# Altium project EVMOMAPL137_Orcad_revg.PrjPcb (part 1 of 4)
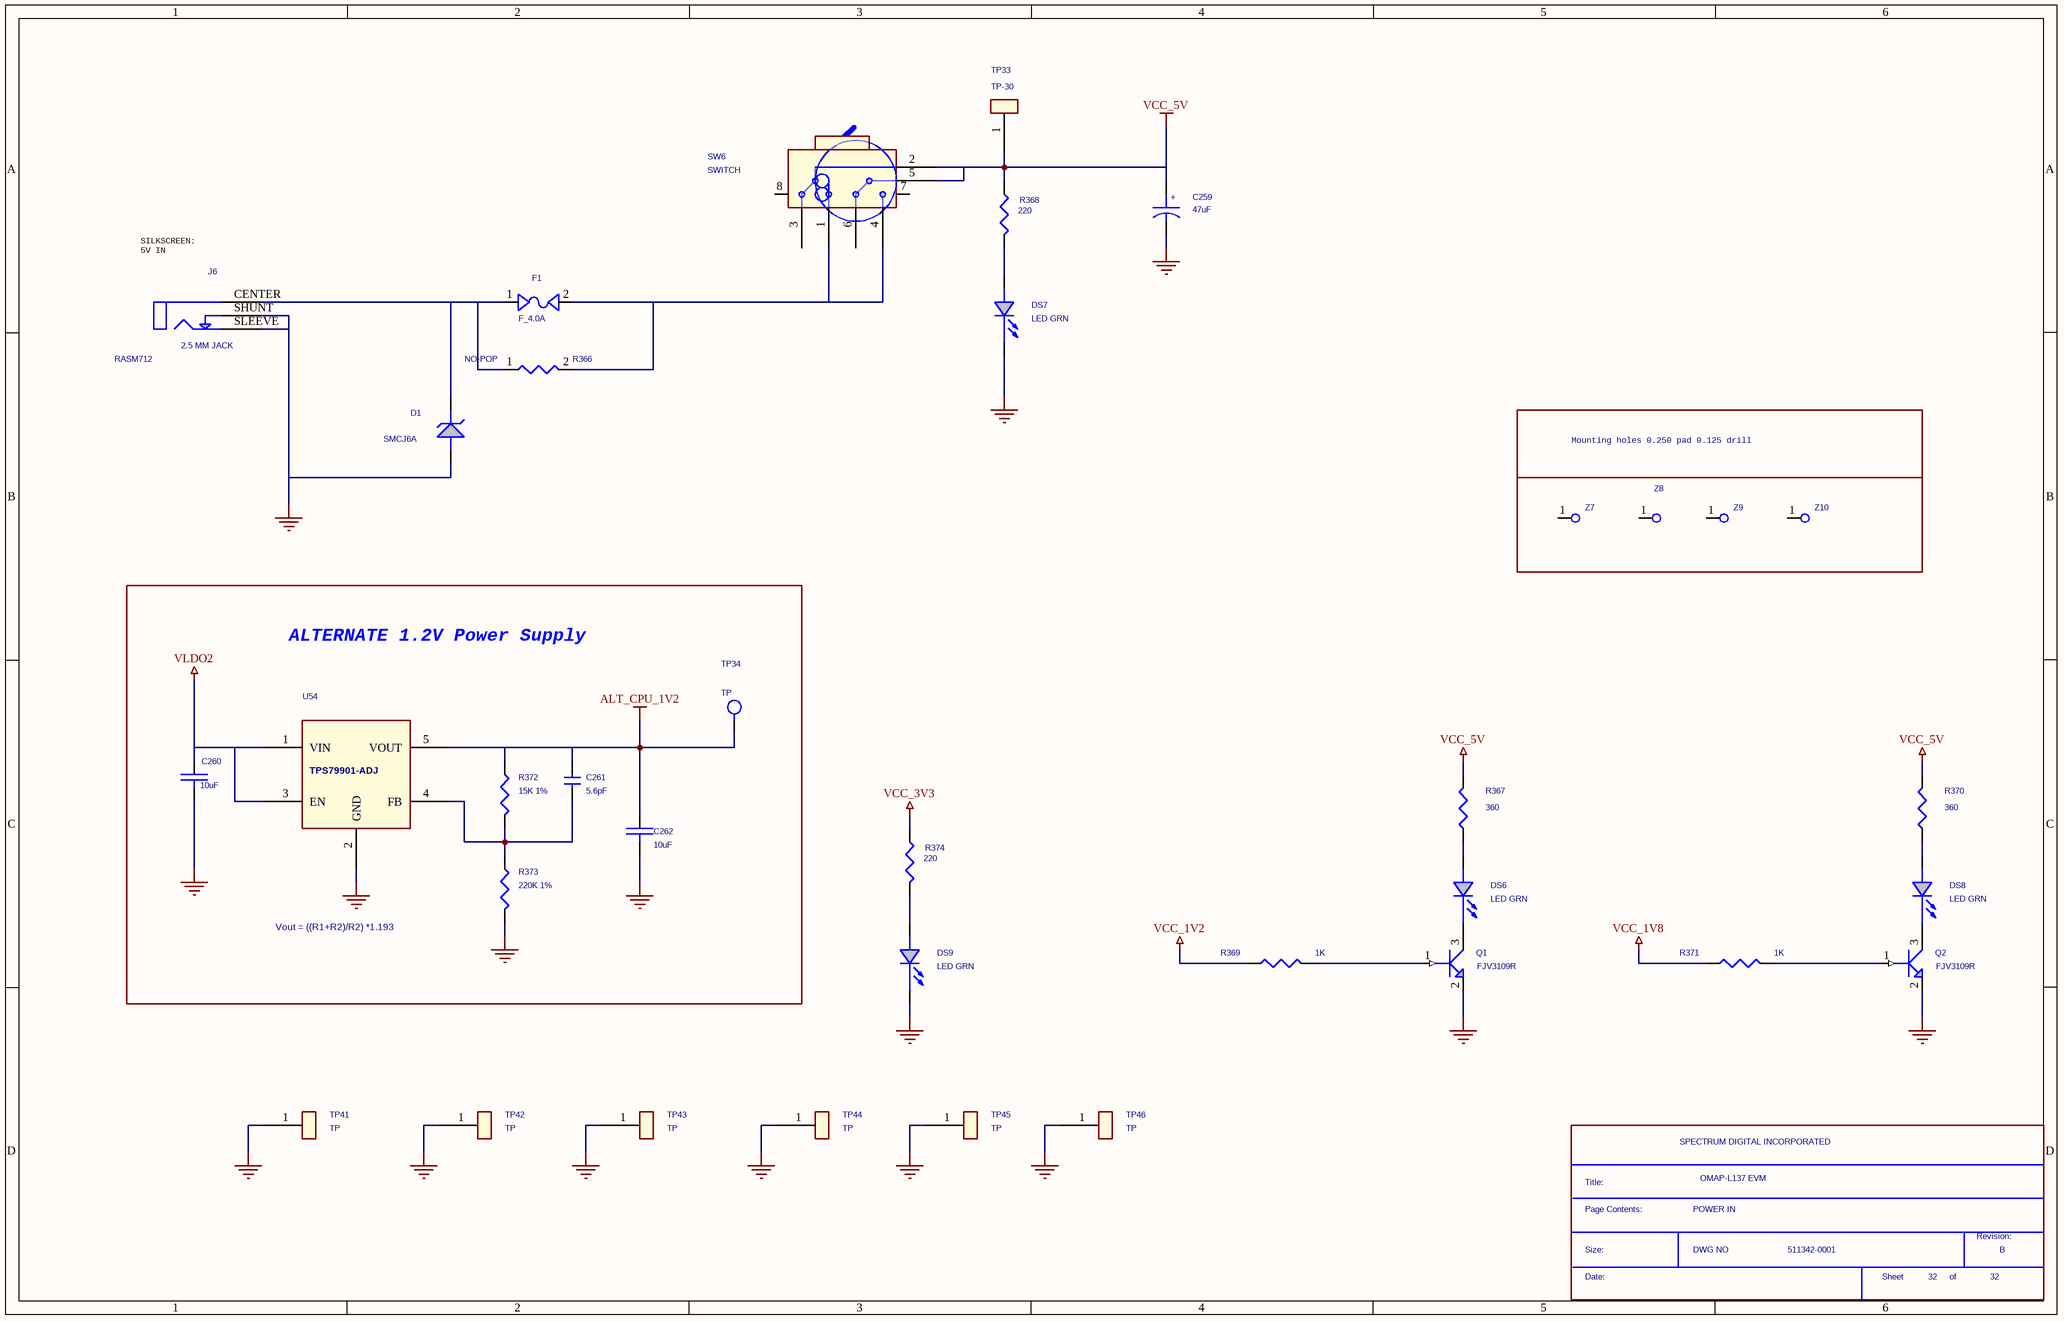
[diagram p0: SH32 - POWER INPUT.SchDoc]
32 sheets, 937 parts. Net scope: hierarchical (ports join the sheet entries above them; power ports are global).
Board file: spd150.PcbDoc
Sheets:
  SH32 - POWER INPUT.SchDoc
  SH31 - POWER II.SchDoc
  SH30 - POWER.SchDoc
  SH29 - EXPANSION3.SchDoc
  SH28 - EXPANSION2.SchDoc
  SH27 - EXPANSION1.SchDoc
  SH26 - ENET PORTS.SchDoc
  SH25 - ENET- POWER.SchDoc
  SH24 - ENET PHY.SchDoc
  SH23 - AIC PHONE AIC.SchDoc
  SH22 - AIC3106.SchDoc
  SH21 - JTAG CONNECTOR.SchDoc
  SH20 - SD_MMC.SchDoc
  SH19 - SD_MMC MUX.SchDoc
  SH18 -  RS232.SchDoc
  SH17 - USER SWITCHES_LE.SchDoc
  SH16 - SPI ROM.SchDoc
  SH15 - SDRAM EMIF B.SchDoc
  SH14 - BOOT MODE.SchDoc
  SH13 - OMAP-L137 CAPS.SchDoc
  SH12 - OMAP-L137 GND.SchDoc
  SH11 - OMAP-L137 POWER.SchDoc
  SH10 - OMAP-L137 JTAG.SchDoc
  SH09 - OMAP-L137 EMIF B.SchDoc
  SH08 - OMAP-L137 EMIF A.SchDoc
  SH07 - OMAP-L137 USB1.SchDoc
  SH06 - OMAP-L137 USB2.SchDoc
  SH05 - SPI MUXING.SchDoc
  SH04 - OMAP-L137 SERIAL.SchDoc
  SH03 - ETHERNET MUXES.SchDoc
  SH02 - OMAP-L137 MCASP.SchDoc
  SH01 - TITLE PAGE.SchDoc

## Sheet SH32 - POWER INPUT.SchDoc
size 386 x 246 mm

### Parts
(Parts that share a designator on the sheet are numbered #1, #2 ... from top to bottom, then left to right.)
*#1  Page Contents:: POWER IN  RevCode: B  Title: OMAP-L137 EVM  OrgName: SPECTRUM DIGITAL INCORPORATED  Doc: 511342-0001  Page Number: 32  (hidden comment: SDTitleBlock)  (graphical)
C259  47uF  [c7343-84x118]
C260  10uF  [C1206-40X70]
C261  5.6pF  [0603]
C262  10uF  [C1206-40X70]
D1  SMCJ6A  [SMC-DO-214AB]
DS6  LED GRN  [led1206-59x59]
DS7  LED GRN  [led1206-59x59]
DS8  LED GRN  [led1206-59x59]
DS9  LED GRN  [led1206-59x59]
F1  F_4.0A  [SM/F_154]
J6  RASM712  [PWR3-RASM712]
Q1  FJV3109R  [sot23-28x44]
Q2  FJV3109R  [sot23-28x44]
R366  NO-POP  [R2512]
R367  360  [r402-25]
R368  220  [r402-25]
R369  1K  [r402-25]
R370  360  [r402-25]
R371  1K  [r402-25]
R372  15K 1%  [r603-35x45]
R373  220K 1%  [r603-35x45]
R374  220  [r402-25]
SW6  SWITCH  [TGL_2X3]
TP33  TP-30  [CON1]
TP34  TP  [tp1-6040]
TP41  TP  [tp1-6040]
TP42  TP  [tp1-6040]
TP43  TP  [tp1-6040]
TP44  TP  [tp1-6040]
TP45  TP  [tp1-6040]
TP46  TP  [tp1-6040]
U54  TPS79901-ADJ  [SMT-DCQ]
Z7  TestPoint1  [TP1_0-2_0]  (value not drawn)
Z8  MNTHOLE  [TP1_0-2_0]  (value not drawn)
Z9  MNTHOLE  [TP1_0-2_0]  (value not drawn)
Z10  MNTHOLE  [TP1_0-2_0]  (value not drawn)

### Blocks framed on the sheet
Mounting holes 0.250 pad 0.125 drill: Z7-Z10
ALTERNATE 1.2V Power Supply: C260-C262 R372 R373 TP34 U54

### Nets
ALT_CPU_1V2: C261.1 C262.1 R372.1 TP34.1(PIN) U54.5(VOUT)
GND: C259.2 C260.2 C262.2 D1.2(Anode) DS7.1(CATHODE) DS9.1(CATHODE) J6.SHUNT J6.SLEEVE Q1.2(EMITTER) Q2.2(EMITTER) R373.2 TP41.1 TP42.1 TP43.1 TP44.1 TP45.1 TP46.1 U54.2(GND)
VCC_1V2: R369.1
VCC_1V8: R371.1
VCC_3V3: R374.1
VCC_5V: C259.1 R367.2 R368.1 R370.2 SW6.2(COMMON1) SW6.5(COMMON2) TP33.1
VLDO2: C260.1 U54.1(VIN) U54.3(EN)
NetC261_2: C261.2 R372.2 R373.1 U54.4(FB)
NetD1_1: D1.1(Cathode) F1.1(P1) J6.CENTER R366.1
NetDS6_1: DS6.1(CATHODE) Q1.3(COLLECTOR)
NetDS6_2: DS6.2(ANODE) R367.1
NetDS7_2: DS7.2(ANODE) R368.2
NetDS8_1: DS8.1(CATHODE) Q2.3(COLLECTOR)
NetDS8_2: DS8.2(ANODE) R370.1
NetDS9_2: DS9.2(ANODE) R374.2
NetF1_2: F1.2(P2) R366.2 SW6.1(NO1) SW6.4(NO2)
NetQ1_1: Q1.1(BASE) R369.2
NetQ2_1: Q2.1(BASE) R371.2

Not connected (* = marked no-connect by the designer): SW6 3(NC1) 6(NC2) 7(MOUNT) 8(MOUNT2); Z7 1; Z8 1; Z9 1; Z10 1

### Notes on the sheet
- (near J6) SILKSCREEN:
  5V IN
- (near J6) 2.5 MM JACK
- Vout = ((R1+R2)/R2) *1.193
- (in symbol CAP P_0) +
- (in symbol SDTitleBlock) Title:; Page Contents:; Revision:; Size:; DWG NO; Date:; Sheet; of

### Library data of the parts
C259 = CAP P_0: Part #: 100995-0471R; SD PCB Footprint: EIA2816P
C260 C262 = Cap 10uF Cermc 6.3V 20% 1206: 10uF Capacitor, Ceramic, 6.3V, 20%, 1206; Part #: 101003-0101R; MfrNum: JMK316BJ106ML; Mfr: TAIYO YUDEN; VendorNum: 587-1942-1-ND; Vendor: Digikey; Cost100: 0.26; Cost10K: 0.056; SD PCB Footprint: EIA1206; PartName: Cap 10uF Cermc 6.3V 20% 1206; TI Footprint: c1206-40x70
C261 = Cap 100nF Cermc 16V 10% 603: 3pF Capacitor, Ceramic, 16V, 10%, 0402; PartName: Cap 3pF Cermc 16V 10% 402; Part #: 101782-1565R; SD PCB Footprint: EIA0402
D1 = SMCJ6_0.0A: Part #: 101808-0006R; SD PCB Footprint: SMC
DS6-DS9 = LED_2: Part #: 100823-0001R; SD PCB Footprint: EIA1206D
F1 = F_2.5A: Part #: 100872-0004R; SD PCB Footprint: F-SMF-OMNI-BLOK
J6 = PHONEJACK_1: Part #: 101238-0001R
Q1 Q2 = 2N2222_0: Part #: 102109-0001R; SD PCB Footprint: SOT23-NPN
R366 = R_2: Part #: R2512-NOPOP; SD PCB Footprint: EIA0603
R367 R370 = R_0: Part #: 101370-3601R
R368 R374 = R: Resistor, 5%, 1/10W; Part #: 101370-2201R; SD PCB Footprint: EIA0603
R369 R371 = R_0: Part #: 101370-1002R
R372 = R: Part #: 100642-1503R
R373 = R: Part #: 100642-2214R
SW6 = SWITCH_1: Part #: 100601-0001; SD PCB Footprint: DPDTSW
TP33 = TEST POINT_0: Part #: SMT-TP030; SD PCB Footprint: CON1
TP34 = Test Point_1: TEST POINT 0.100; PartName: HEADER 1; Part #: 100115-0001R; Vendor: Digikey; Vendor Nbr: S2111-36-ND; Cost10K: 0.018; Cost100: 0.031; VendorNum: S2011-36-ND; Assy_NO-POP: Do Not Populate; TI Footprint: tp1-6040
TP41-TP46 = TEST POINT
U54 = U-TPS79901 - 1.19 to 6.5V 200mA: Single Output LDO, 200mA, Adj. 1.193 to 6.5V; Part #: 102636-0001R; PartName: U - TPS79901-ADJ LDO; Mfr: TI; MfrNum: TPS79901DDC; TI Footprint: SOT-DDC; Cost10K: 0.3; Cost100: 0.58; VendorNum: 296-17776-1-ND; Vendor: Digikey
Z7-Z10 = TestPoint1: ATLStockNo1: none
*#1 = SDTitleBlock: Page Count: 32

## Sheet SH31 - POWER II.SchDoc
size 386 x 246 mm
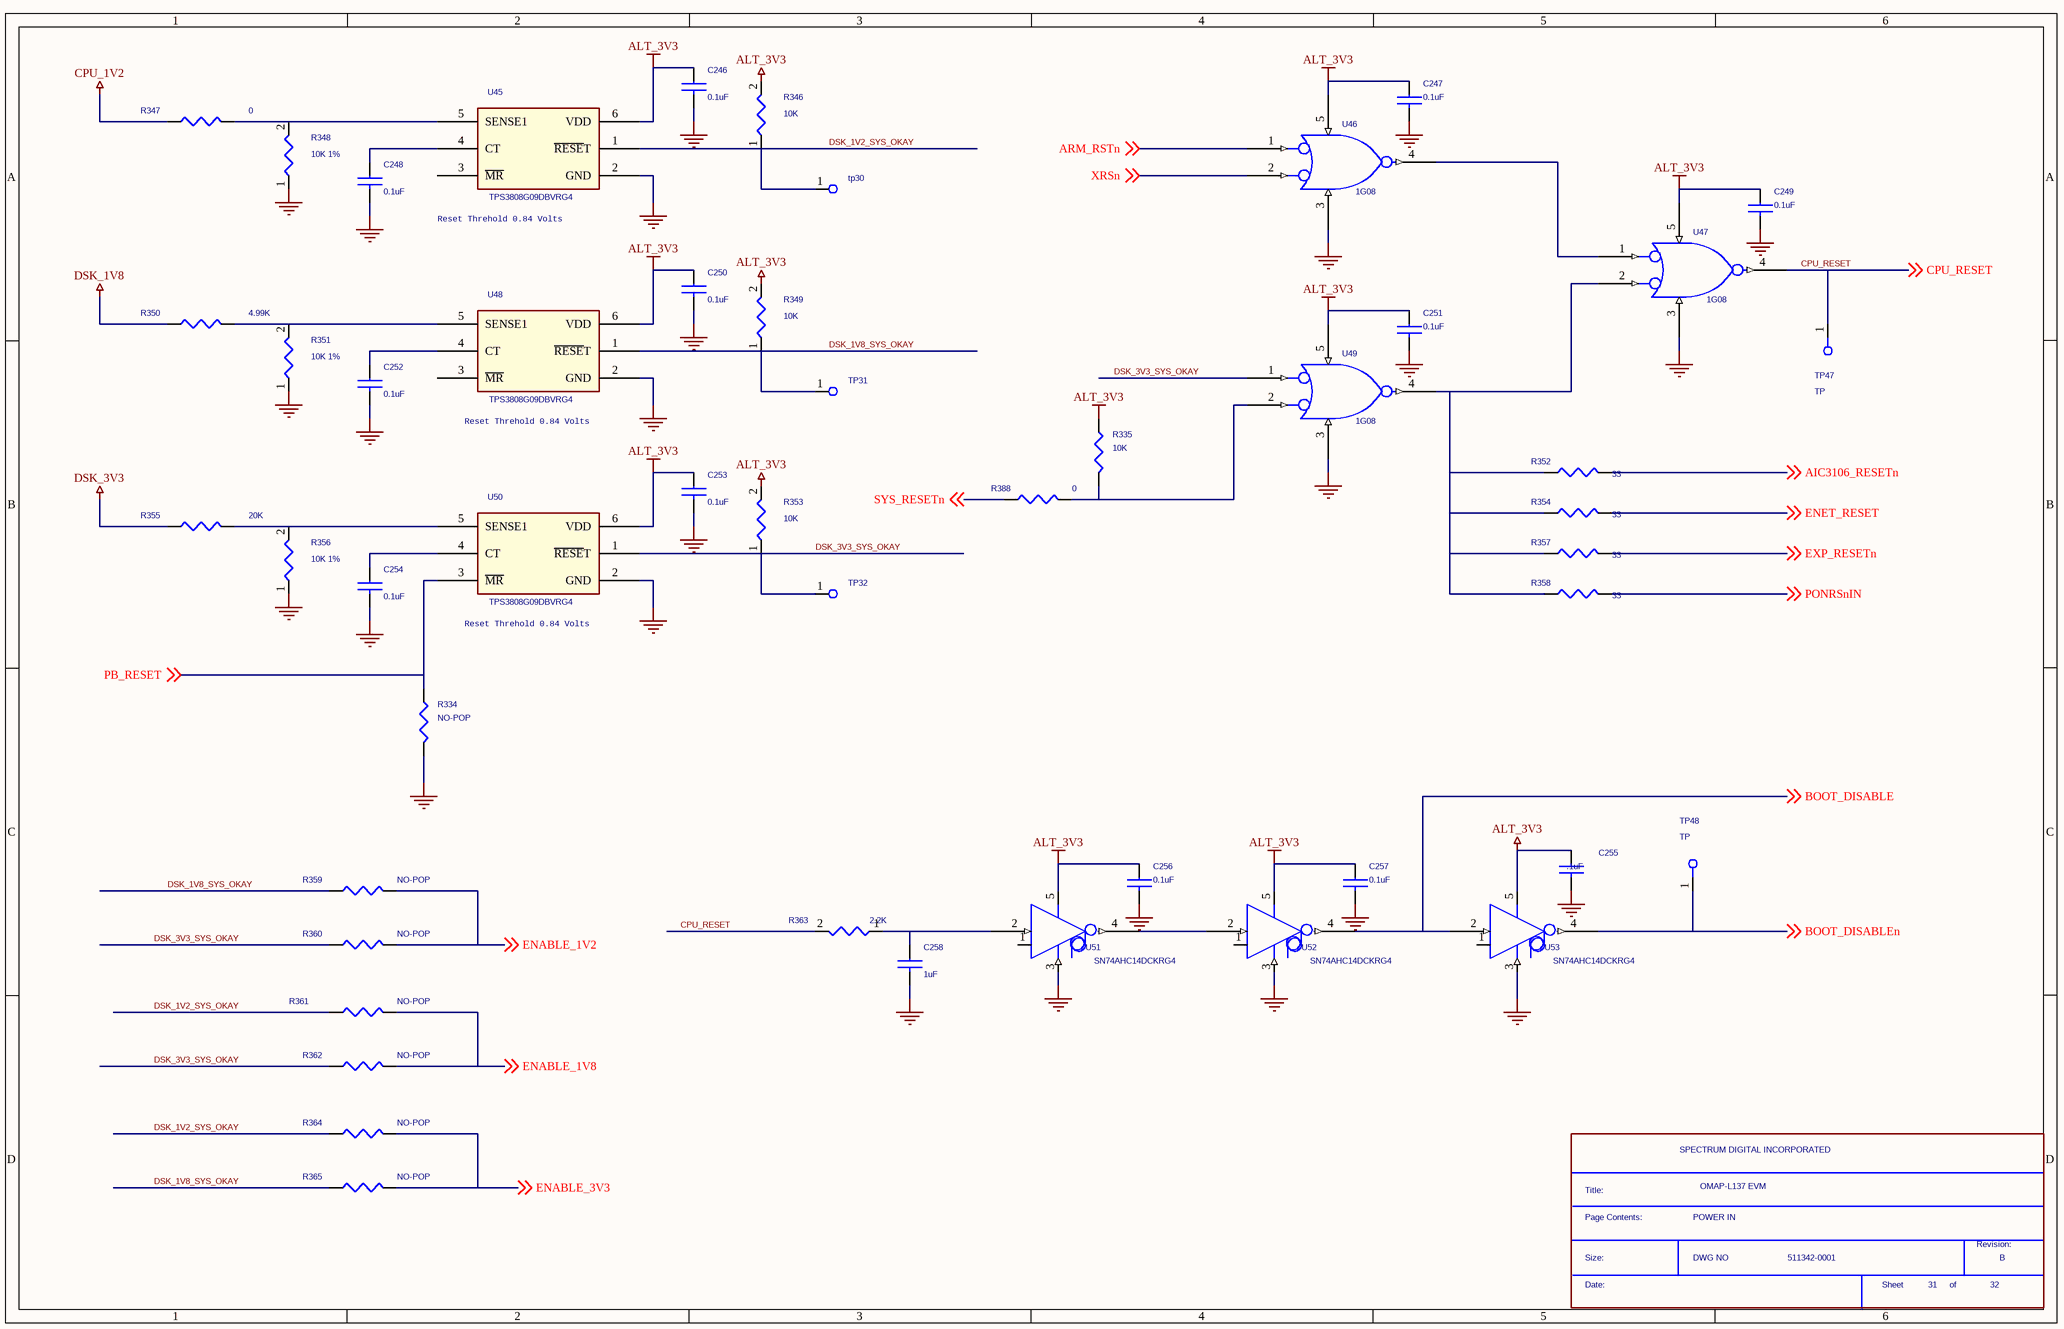
[diagram p1: SH31 - POWER II.SchDoc]

### Parts
(Parts that share a designator on the sheet are numbered #1, #2 ... from top to bottom, then left to right.)
*#2  Page Contents:: POWER IN  RevCode: B  Title: OMAP-L137 EVM  OrgName: SPECTRUM DIGITAL INCORPORATED  Doc: 511342-0001  Page Number: 31  Page Count: 32  (hidden comment: SDTitleBlock)  (graphical)
C246  0.1uF  [c402-25]
C247  0.1uF  [c402-25]
C248  0.1uF  [c402-25]
C249  0.1uF  [c402-25]
C250  0.1uF  [c402-25]
C251  0.1uF  [c402-25]
C252  0.1uF  [c402-25]
C253  0.1uF  [c402-25]
C254  0.1uF  [c402-25]
C255  .1uF  [c402-25]
C256  0.1uF  [c402-25]
C257  0.1uF  [c402-25]
C258  1uF  [c402-25]
R334  NO-POP  [r402-25]
R335  10K  [r402-25]
R346  10K  [r402-25]
R347  0  [r402-25]
R348  10K 1%  [r402-25]
R349  10K  [r402-25]
R350  4.99K  [r603-35x45]
R351  10K 1%  [r402-25]
R352  33  [r402-25]
R353  10K  [r402-25]
R354  33  [r402-25]
R355  20K  [r402-25]
R356  10K 1%  [r402-25]
R357  33  [r402-25]
R358  33  [r402-25]
R359  NO-POP  [r402-25]
R360  NO-POP  [r402-25]
R361  NO-POP  [r402-25]
R362  NO-POP  [r402-25]
R363  2.2K  [r402-25]
R364  NO-POP  [r402-25]
R365  NO-POP  [r402-25]
R388  0  [r402-25]
tp30  TestPoint1  [TP1_0-2_0]  (value not drawn)
TP31  TestPoint1  [TP1_0-2_0]  (value not drawn)
TP32  TestPoint1  [TP1_0-2_0]  (value not drawn)
TP47  TP  [tp1-6040]
TP48  TP  [tp1-6040]
U45  TPS3808G09DBVRG4  [DBV6-27X39-6]
U46  1G08  [SO5]
U47  1G08  [SO5]
U48  TPS3808G09DBVRG4  [DBV6-27X39-6]
U49  1G08  [SO5]
U50  TPS3808G09DBVRG4  [DBV6-27X39-6]
U51  SN74AHC14DCKRG4  [DCK]
U52  SN74AHC14DCKRG4  [DCK]
U53  SN74AHC14DCKRG4  [DCK]

### Nets
ALT_3V3: C246.1 C247.1 C249.1 C250.1 C251.1 C253.1 C255.1 C256.1 C257.1 R335.1 R346.2 R349.2 R353.2 U45.6(VDD) U46.5(VCC) U47.5(VCC) U48.6(VDD) U49.5(VCC) U50.6(VDD) U51.5(VCC) U52.5(VCC) U53.5(VCC)
CPU_1V2: R347.1
DSK_1V8: R350.1
DSK_3V3: R355.1
GND: C246.2 C247.2 C248.2 C249.2 C250.2 C251.2 C252.2 C253.2 C254.2 C255.2 C256.2 C257.2 C258.2 R334.2 R348.1 R351.1 R356.1 U45.2(GND) U46.3(GND) U47.3(GND) U48.2(GND) U49.3(GND) U50.2(GND) U51.3(GND) U52.3(GND) U53.3(GND)
AIC3106_RESETn: R352.1 ; off-sheet AIC3106_RESETn
ARM_RSTn: U46.1(B) ; off-sheet ARM_RSTn
BOOT_DISABLE: U52.4(O) U53.2(I) ; off-sheet BOOT_DISABLE
BOOT_DISABLEn: TP48.1 U53.4(O) ; off-sheet BOOT_DISABLEn
CPU_RESET: R363.2 TP47.1 U47.4(Y) ; off-sheet CPU_RESET
DSK_1V2_SYS_OKAY: R346.1 R361.1 R364.1 tp30.1 U45.1(~{RESE}T)
DSK_1V8_SYS_OKAY: R349.1 R359.1 R365.1 TP31.1 U48.1(~{RESE}T)
DSK_3V3_SYS_OKAY: R353.1 R360.1 R362.1 TP32.1 U49.1(B) U50.1(~{RESE}T)
ENABLE_1V2: R359.2 R360.2 ; off-sheet ENABLE_1V2
ENABLE_1V8: R361.2 R362.2 ; off-sheet ENABLE_1V8
ENABLE_3V3: R364.2 R365.2 ; off-sheet ENABLE_3V3
ENET_RESET: R354.1 ; off-sheet ENET_RESET
EXP_RESETn: R357.1 ; off-sheet EXP_RESETn
PB_RESET: R334.1 U50.3(~{MR}) ; off-sheet PB_RESET
PONRSnIN: R358.1 ; off-sheet PONRSnIN
SYS_RESETn: R388.1 ; off-sheet SYS_RESETn
XRSn: U46.2(A) ; off-sheet XRSn
NetC248_1: C248.1 U45.4(CT)
NetC252_1: C252.1 U48.4(CT)
NetC254_1: C254.1 U50.4(CT)
NetC258_1: C258.1 R363.1 U51.2(I)
NetR335_2: R335.2 R388.2 U49.2(A)
NetR347_2: R347.2 R348.2 U45.5(SENSE1)
NetR350_2: R350.2 R351.2 U48.5(SENSE1)
NetR352_2: R352.2 R354.2 R357.2 R358.2 U47.2(A) U49.4(Y)
NetR355_2: R355.2 R356.2 U50.5(SENSE1)
NetU46_4: U46.4(Y) U47.1(B)
NetU51_4: U51.4(O) U52.2(I)

Not connected (* = marked no-connect by the designer): U45 3(~{MR}); U48 3(~{MR}); U51 1(NC1); U52 1(NC1); U53 1(NC1)

### Notes on the sheet
- (near U45) Reset Threhold 0.84 Volts
- (near U48) Reset Threhold 0.84 Volts
- (near U50) Reset Threhold 0.84 Volts
- (in symbol SDTitleBlock) Title:; Page Contents:; Revision:; Size:; DWG NO; Date:; Sheet; of

### Library data of the parts
C246 C248 C250 C252-C254 C258 = CAP NP_2: Part #: 101587-1100R; SD PCB Footprint: EIA0603
C247 C249 C251 C256 C257 = CAP NP_0: Capacitor, Ceramic, 16V, X7R, 10%; Part #: 101587-1100R
C255 = CAP NP_2: Part #: 101587-1100R
R334 R359-R362 R364 R365 = R: Part #: R0402-NOPOP
R335 = R: Part #: 101370-1003R
R346 R349 R353 = R_2: Part #: 101370-1003R; SD PCB Footprint: EIA0603
R347 R388 = R: Part #: 101370-0001R
R348 R351 R356 = R_2: Part #: 102145-1003R; SD PCB Footprint: EIA0603
R350 = R: Part #: 100642-4992R
R352 R354 R357 R358 = R_1: Resistor, 5%, 1/16W; Part #: 101370-3300R
R355 = R: Part #: 101370-2003R
R363 = R_2: Part #: 101370-2202R; SD PCB Footprint: EIA0603
tp30 TP31 TP32 = TestPoint1: Part #: 100115-0001R; ATLStockNo1: none
TP47 TP48 = TP_0
U45 U48 U50 = TPS3808G09DBVR_0: Part #: 102020-0009R
U46 U47 U49 = 1G08: Part #: 101057-0008R
U51 = SN74LVC1GU04_1: Spectrum Part#: 101027-0125; Part #: 101027-0001R
U52 U53 = SN74LVC1GU04_1: Part #: 101027-0001R; Spectrum Part#: 101027-0125

## Sheet SH30 - POWER.SchDoc
size 386 x 246 mm
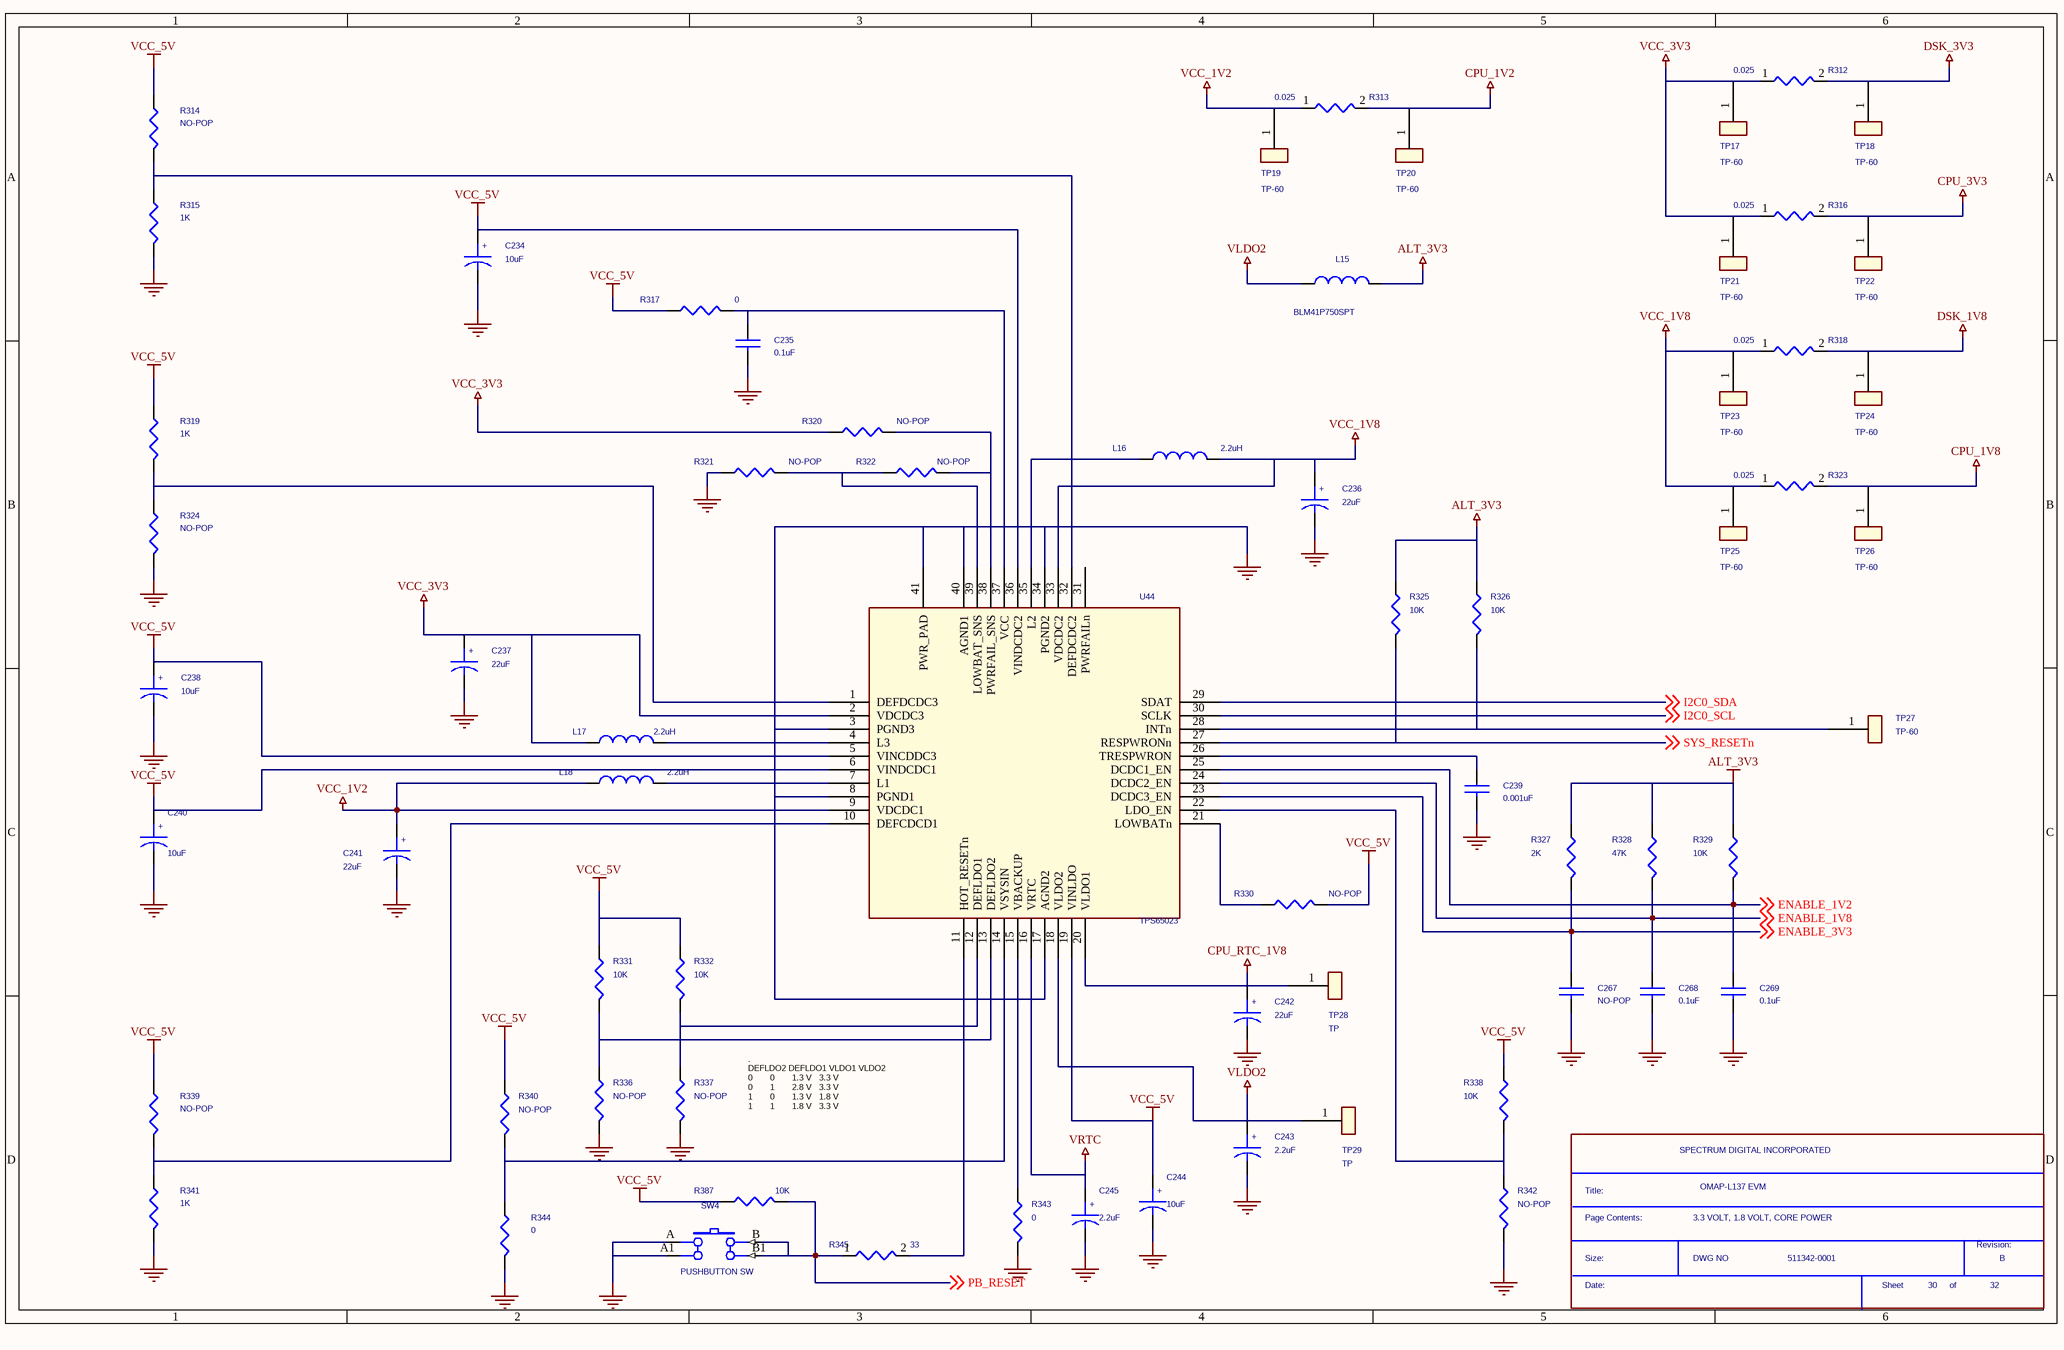
[diagram p2: SH30 - POWER.SchDoc]

### Parts
(Parts that share a designator on the sheet are numbered #1, #2 ... from top to bottom, then left to right.)
*#3  Page Contents:: 3.3 VOLT, 1.8 VOLT, CORE POWER  RevCode: B  Title: OMAP-L137 EVM  OrgName: SPECTRUM DIGITAL INCORPORATED  Doc: 511342-0001  Page Number: 30  Page Count: 32  (hidden comment: SDTitleBlock)  (graphical)
C234  10uF  [c1206-40x70-POL]
C235  0.1uF  [c402-25]
C236  22uF  [C1206-40X70]
C237  22uF  [C1206-40X70]
C238  10uF  [c1206-40x70-POL]
C239  0.001uF  [c402-25]
C240  10uF  [c1206-40x70-POL]
C241  22uF  [C1206-40X70]
C242  22uF  [C1206-40X70]
C243  2.2uF  [c603-35x45]
C244  10uF  [c1206-40x70-POL]
C245  2.2uF  [c603-35x45]
C267  NO-POP  [c402-25]
C268  0.1uF  [c402-25]
C269  0.1uF  [c402-25]
L15  BLM41P750SPT  [FB1806-41X70]
L16  2.2uH  [ind_vlcf]
L17  2.2uH  [ind_vlcf]
L18  2.2uH  [ind_vlcf]
R312  0.025  [R2512]
R313  0.025  [R2512]
R314  NO-POP  [r402-25]
R315  1K  [r402-25]
R316  0.025  [R2512]
R317  0  [r402-25]
R318  0.025  [R2512]
R319  1K  [r402-25]
R320  NO-POP  [r402-25]
R321  NO-POP  [r402-25]
R322  NO-POP  [r402-25]
R323  0.025  [R2512]
R324  NO-POP  [r402-25]
R325  10K  [r402-25]
R326  10K  [r402-25]
R327  2K  [r402-25]
R328  47K  [r402-25]
R329  10K  [r402-25]
R330  NO-POP  [r402-25]
R331  10K  [r402-25]
R332  10K  [r402-25]
R336  NO-POP  [r402-25]
R337  NO-POP  [r402-25]
R338  10K  [r402-25]
R339  NO-POP  [r402-25]
R340  NO-POP  [r402-25]
R341  1K  [r402-25]
R342  NO-POP  [r402-25]
R343  0  [r402-25]
R344  0  [r402-25]
R345  33  [r402-25]
R387  10K  [r402-25]
SW4  PUSHBUTTON SW  [???]
TP17  TP-60  [CON1]
TP18  TP-60  [CON1]
TP19  TP-60  [CON1]
TP20  TP-60  [CON1]
TP21  TP-60  [CON1]
TP22  TP-60  [CON1]
TP23  TP-60  [CON1]
TP24  TP-60  [CON1]
TP25  TP-60  [CON1]
TP26  TP-60  [CON1]
TP27  TP-60  [CON1]
TP28  TP  [CON1]
TP29  TP  [CON1]
U44  TPS65023  [rsb40-9x39]

### Nets
ALT_3V3: L15.1 R325.1 R326.1 R327.1 R328.1 R329.1
CPU_1V2: R313.2 TP20.1
CPU_1V8: R323.2 TP26.1
CPU_3V3: R316.2 TP22.1
CPU_RTC_1V8: C242.1 TP28.1 U44.20(VLDO1)
DSK_1V8: R318.2 TP24.1
DSK_3V3: R312.2 TP18.1
GND: C234.2 C235.2 C236.2 C237.2 C238.2 C239.2 C240.2 C241.2 C242.2 C243.2 C244.2 C245.2 C267.2 C268.2 C269.2 R315.2 R321.1 R324.2 R336.2 R337.2 R341.2 R342.2 R343.2 R344.2 SW4.A SW4.A1 U44.3(PGND3) U44.8(PGND1) U44.17(AGND2) U44.34(PGND2) U44.40(AGND1) U44.41(PWR_PAD)
VCC_1V2: C241.1 L18.1 R313.1 TP19.1 U44.9(VDCDC1)
VCC_1V8: C236.1 L16.2 R318.1 R323.1 TP23.1 TP25.1 U44.33(VDCDC2)
VCC_3V3: C237.1 L17.1 R312.1 R316.1 R320.1 TP17.1 TP21.1 U44.2(VDCDC3)
VCC_5V: C234.1 C238.1 C240.1 C244.1 R314.1 R317.1 R319.1 R330.2 R331.1 R332.1 R338.1 R339.1 R340.1 R387.1 U44.5(VINCDDC3) U44.6(VINDCDC1) U44.19(VINLDO) U44.36(VINDCDC2)
VLDO2: C243.1 L15.2 TP29.1 U44.18(VLDO2)
VRTC: C245.1 U44.16(VRTC)
ENABLE_1V2: C269.1 R329.2 U44.25(DCDC1_EN) ; off-sheet ENABLE_1V2
ENABLE_1V8: C268.1 R328.2 U44.24(DCDC2_EN) ; off-sheet ENABLE_1V8
ENABLE_3V3: C267.1 R327.2 U44.23(DCDC3_EN) ; off-sheet ENABLE_3V3
I2C0_SCL: U44.30(SCLK) ; off-sheet I2C0_SCL
I2C0_SDA: U44.29(SDAT) ; off-sheet I2C0_SDA
PB_RESET: R345.1 R387.2 SW4.B SW4.B1 ; off-sheet PB_RESET
SYS_RESETn: R325.2 U44.27(RESPWRONn) ; off-sheet SYS_RESETn
NetC235_1: C235.1 R317.2 U44.37(VCC)
NetC239_1: C239.1 U44.26(TRESPWRON)
NetL16_1: L16.1 U44.35(L2)
NetL17_2: L17.2 U44.4(L3)
NetL18_2: L18.2 U44.7(L1)
NetR314_2: R314.2 R315.1 U44.32(DEFDCDC2)
NetR319_2: R319.2 R324.1 U44.1(DEFDCDC3)
NetR320_2: R320.2 R322.2 U44.38(PWRFAIL_SNS)
NetR321_2: R321.2 R322.1 U44.39(LOWBAT_SNS)
NetR326_2: R326.2 TP27.1 U44.28(INTn)
NetR330_1: R330.1 U44.21(LOWBATn)
NetR331_2: R331.2 R336.1 U44.13(DEFLDO2)
NetR332_2: R332.2 R337.1 U44.12(DEFLDO1)
NetR338_2: R338.2 R342.1 U44.22(LDO_EN)
NetR339_2: R339.2 R341.1 U44.10(DEFCDCD1)
NetR340_2: R340.2 R344.1 U44.14(VSYSIN)
NetR343_1: R343.1 U44.15(VBACKUP)
NetR345_2: R345.2 U44.11(HOT_RESETn)

Not connected (* = marked no-connect by the designer): U44 31(PWRFAILn)

### Notes on the sheet
- .
  DEFLDO2 DEFLDO1 VLDO1 VLDO2
  0       0       1.3 V   3.3 V
  0       1       2.8 V   3.3 V
  1       0       1.3 V   1.8 V
  1       1       1.8 V   3.3 V
- (in symbol CAP P_0) +
- (in symbol SDTitleBlock) Title:; Page Contents:; Revision:; Size:; DWG NO; Date:; Sheet; of

### Library data of the parts
C234 C238 C240 C244 = CAP P_0: Part #: 101003-0101R; SD PCB Footprint: EIA1210
C235 C268 C269 = CAP NP: Part #: 101587-1100R
C236 C237 C241 C242 = CAP P_0: Part #: 101064-0221R; SD PCB Footprint: EIA1210
C239 = CAP NP: Part #: 102058-1102R
C243 C245 = CAP P_0: Part #: 101007-0220R; SD PCB Footprint: EIA1210
C267 = CAP NP: Part #: C0402-NOPOP
L15 = INDUCTOR_0: Part Number: 134; Part #: 101126-0001R
L16-L18 = INDUCTOR_0: Part Number: 134; Part #: 102747-0220R
R312 R313 R316 R318 R323 = R_2: Part #: 100830-0025R; SD PCB Footprint: EIA0603
R314 R320-R322 R324 R330 R336 R337 R339 R340 = R_0: Part #: R0402-NOPOP
R315 R319 R341 = R_0: Part #: 101370-1002R
R317 R344 = R_0: Part #: 101370-0001R
R325 R326 R329 R331 R332 R338 = R_0: Part #: 101370-1003R
R327 = R_0: Part #: 101370-2002R
R328 = R_0: Part #: 101370-4703R
R342 = R_0: Part #: R0402-nopop
R343 = R: Part #: 101370-0001R
R345 = R_2: Part #: 101370-3300R; SD PCB Footprint: EIA0603
R387 = R: Part #: 101370-1003R
SW4 = EVQ-PLMA15_2: Pushbutton, Momentary, Thru Hole; Part #: 101215-0001R; SD PCB Footprint: 101215
TP17-TP29 = TEST POINT_0: Part #: 100115-0001R
  TP17-TP27: SD PCB Footprint: CON1
U44 = TPS65023_0: Part #: 102746-0001R

## Sheet SH29 - EXPANSION3.SchDoc
size 386 x 246 mm
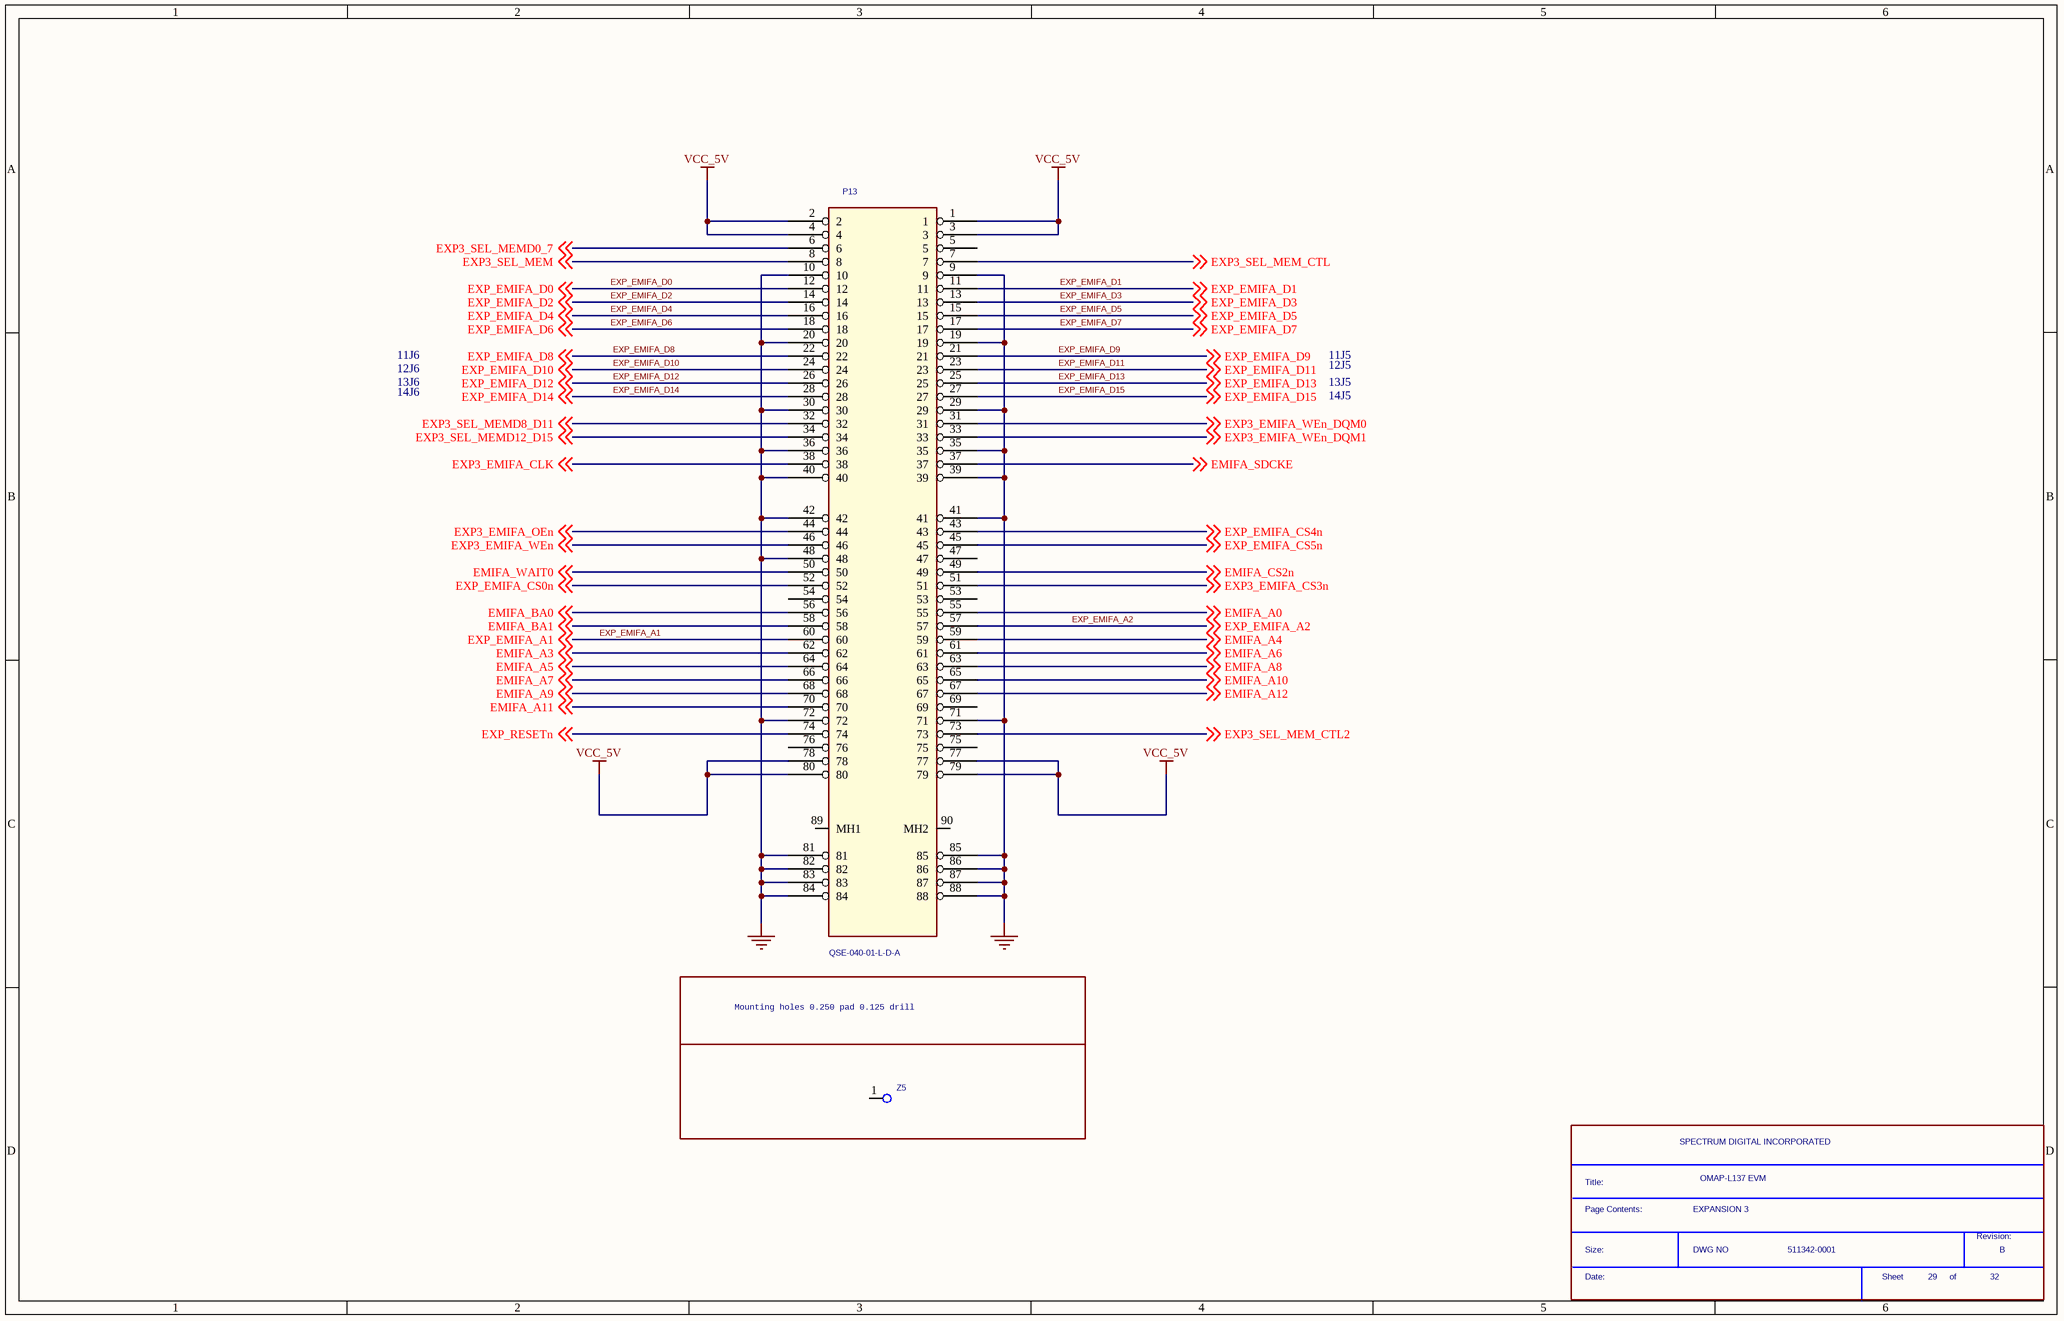
[diagram p3: SH29 - EXPANSION3.SchDoc]

### Parts
(Parts that share a designator on the sheet are numbered #1, #2 ... from top to bottom, then left to right.)
*#4  Page Contents:: EXPANSION 3  RevCode: B  Title: OMAP-L137 EVM  OrgName: SPECTRUM DIGITAL INCORPORATED  Doc: 511342-0001  Page Number: 29  Page Count: 32  (hidden comment: SDTitleBlock)  (graphical)
P13  QSE-040-01-L-D-A  [qse_040]
Z5  MNTHOLE  [TP1_0-2_0]  (value not drawn)

### Blocks framed on the sheet
Mounting holes 0.250 pad 0.125 drill: Z5

### Nets
GND: P13.9 P13.10 P13.19 P13.20 P13.29 P13.30 P13.35 P13.36 P13.39 P13.40 P13.41 P13.42 P13.48 P13.71 P13.72 P13.81 P13.82 P13.83 P13.84 P13.85 P13.86 P13.87 P13.88
VCC_5V: P13.1 P13.2 P13.3 P13.4 P13.77 P13.78 P13.79 P13.80
EMIFA_A0: P13.55 ; off-sheet EMIFA_A0
EMIFA_A3: P13.62 ; off-sheet EMIFA_A3
EMIFA_A4: P13.59 ; off-sheet EMIFA_A4
EMIFA_A5: P13.64 ; off-sheet EMIFA_A5
EMIFA_A6: P13.61 ; off-sheet EMIFA_A6
EMIFA_A7: P13.66 ; off-sheet EMIFA_A7
EMIFA_A8: P13.63 ; off-sheet EMIFA_A8
EMIFA_A9: P13.68 ; off-sheet EMIFA_A9
EMIFA_A10: P13.65 ; off-sheet EMIFA_A10
EMIFA_A11: P13.70 ; off-sheet EMIFA_A11
EMIFA_A12: P13.67 ; off-sheet EMIFA_A12
EMIFA_BA0: P13.56 ; off-sheet EMIFA_BA0
EMIFA_BA1: P13.58 ; off-sheet EMIFA_BA1
EMIFA_CS2n: P13.49 ; off-sheet EMIFA_CS2n
EMIFA_SDCKE: P13.37 ; off-sheet EMIFA_SDCKE
EMIFA_WAIT0: P13.50 ; off-sheet EMIFA_WAIT0
EXP3_EMIFA_CLK: P13.38 ; off-sheet EXP3_EMIFA_CLK
EXP3_EMIFA_CS3n: P13.51 ; off-sheet EXP3_EMIFA_CS3n
EXP3_EMIFA_OEn: P13.44 ; off-sheet EXP3_EMIFA_OEn
EXP3_EMIFA_WEn: P13.46 ; off-sheet EXP3_EMIFA_WEn
EXP3_EMIFA_WEn_DQM0: P13.31 ; off-sheet EXP3_EMIFA_WEn_DQM0
EXP3_EMIFA_WEn_DQM1: P13.33 ; off-sheet EXP3_EMIFA_WEn_DQM1
EXP3_SEL_MEM: P13.8 ; off-sheet EXP3_SEL_MEM
EXP3_SEL_MEM_CTL: P13.7 ; off-sheet EXP3_SEL_MEM_CTL
EXP3_SEL_MEM_CTL2: P13.73 ; off-sheet EXP3_SEL_MEM_CTL2
EXP3_SEL_MEMD0_7: P13.6 ; off-sheet EXP3_SEL_MEMD0_7
EXP3_SEL_MEMD8_D11: P13.32 ; off-sheet EXP3_SEL_MEMD8_D11
EXP3_SEL_MEMD12_D15: P13.34 ; off-sheet EXP3_SEL_MEMD12_D15
EXP_EMIFA_A1: P13.60 ; off-sheet EXP_EMIFA_A1
EXP_EMIFA_A2: P13.57 ; off-sheet EXP_EMIFA_A2
EXP_EMIFA_CS0n: P13.52 ; off-sheet EXP_EMIFA_CS0n
EXP_EMIFA_CS4n: P13.43 ; off-sheet EXP_EMIFA_CS4n
EXP_EMIFA_CS5n: P13.45 ; off-sheet EXP_EMIFA_CS5n
EXP_EMIFA_D0: P13.12 ; off-sheet EXP_EMIFA_D0
EXP_EMIFA_D1: P13.11 ; off-sheet EXP_EMIFA_D1
EXP_EMIFA_D2: P13.14 ; off-sheet EXP_EMIFA_D2
EXP_EMIFA_D3: P13.13 ; off-sheet EXP_EMIFA_D3
EXP_EMIFA_D4: P13.16 ; off-sheet EXP_EMIFA_D4
EXP_EMIFA_D5: P13.15 ; off-sheet EXP_EMIFA_D5
EXP_EMIFA_D6: P13.18 ; off-sheet EXP_EMIFA_D6
EXP_EMIFA_D7: P13.17 ; off-sheet EXP_EMIFA_D7
EXP_EMIFA_D8: P13.22 ; off-sheet EXP_EMIFA_D8
EXP_EMIFA_D9: P13.21 ; off-sheet EXP_EMIFA_D9
EXP_EMIFA_D10: P13.24 ; off-sheet EXP_EMIFA_D10
EXP_EMIFA_D11: P13.23 ; off-sheet EXP_EMIFA_D11
EXP_EMIFA_D12: P13.26 ; off-sheet EXP_EMIFA_D12
EXP_EMIFA_D13: P13.25 ; off-sheet EXP_EMIFA_D13
EXP_EMIFA_D14: P13.28 ; off-sheet EXP_EMIFA_D14
EXP_EMIFA_D15: P13.27 ; off-sheet EXP_EMIFA_D15
EXP_RESETn: P13.74 ; off-sheet EXP_RESETn

Not connected (* = marked no-connect by the designer): P13 5 47 53 54 69 75 76 89(MH1) 90(MH2); Z5 1

### Notes on the sheet
- 11J6
- 12J6
- 13J6
- 14J6
- 11J5
- 12J5
- 13J5
- 14J5
- (in symbol SDTitleBlock) Title:; Page Contents:; Revision:; Size:; DWG NO; Date:; Sheet; of

### Library data of the parts
P13 = QSE-040-01-L-D-A: Part #: 101881-0040R
Z5 = TestPoint1: ATLStockNo1: none

## Sheet SH28 - EXPANSION2.SchDoc
size 386 x 246 mm
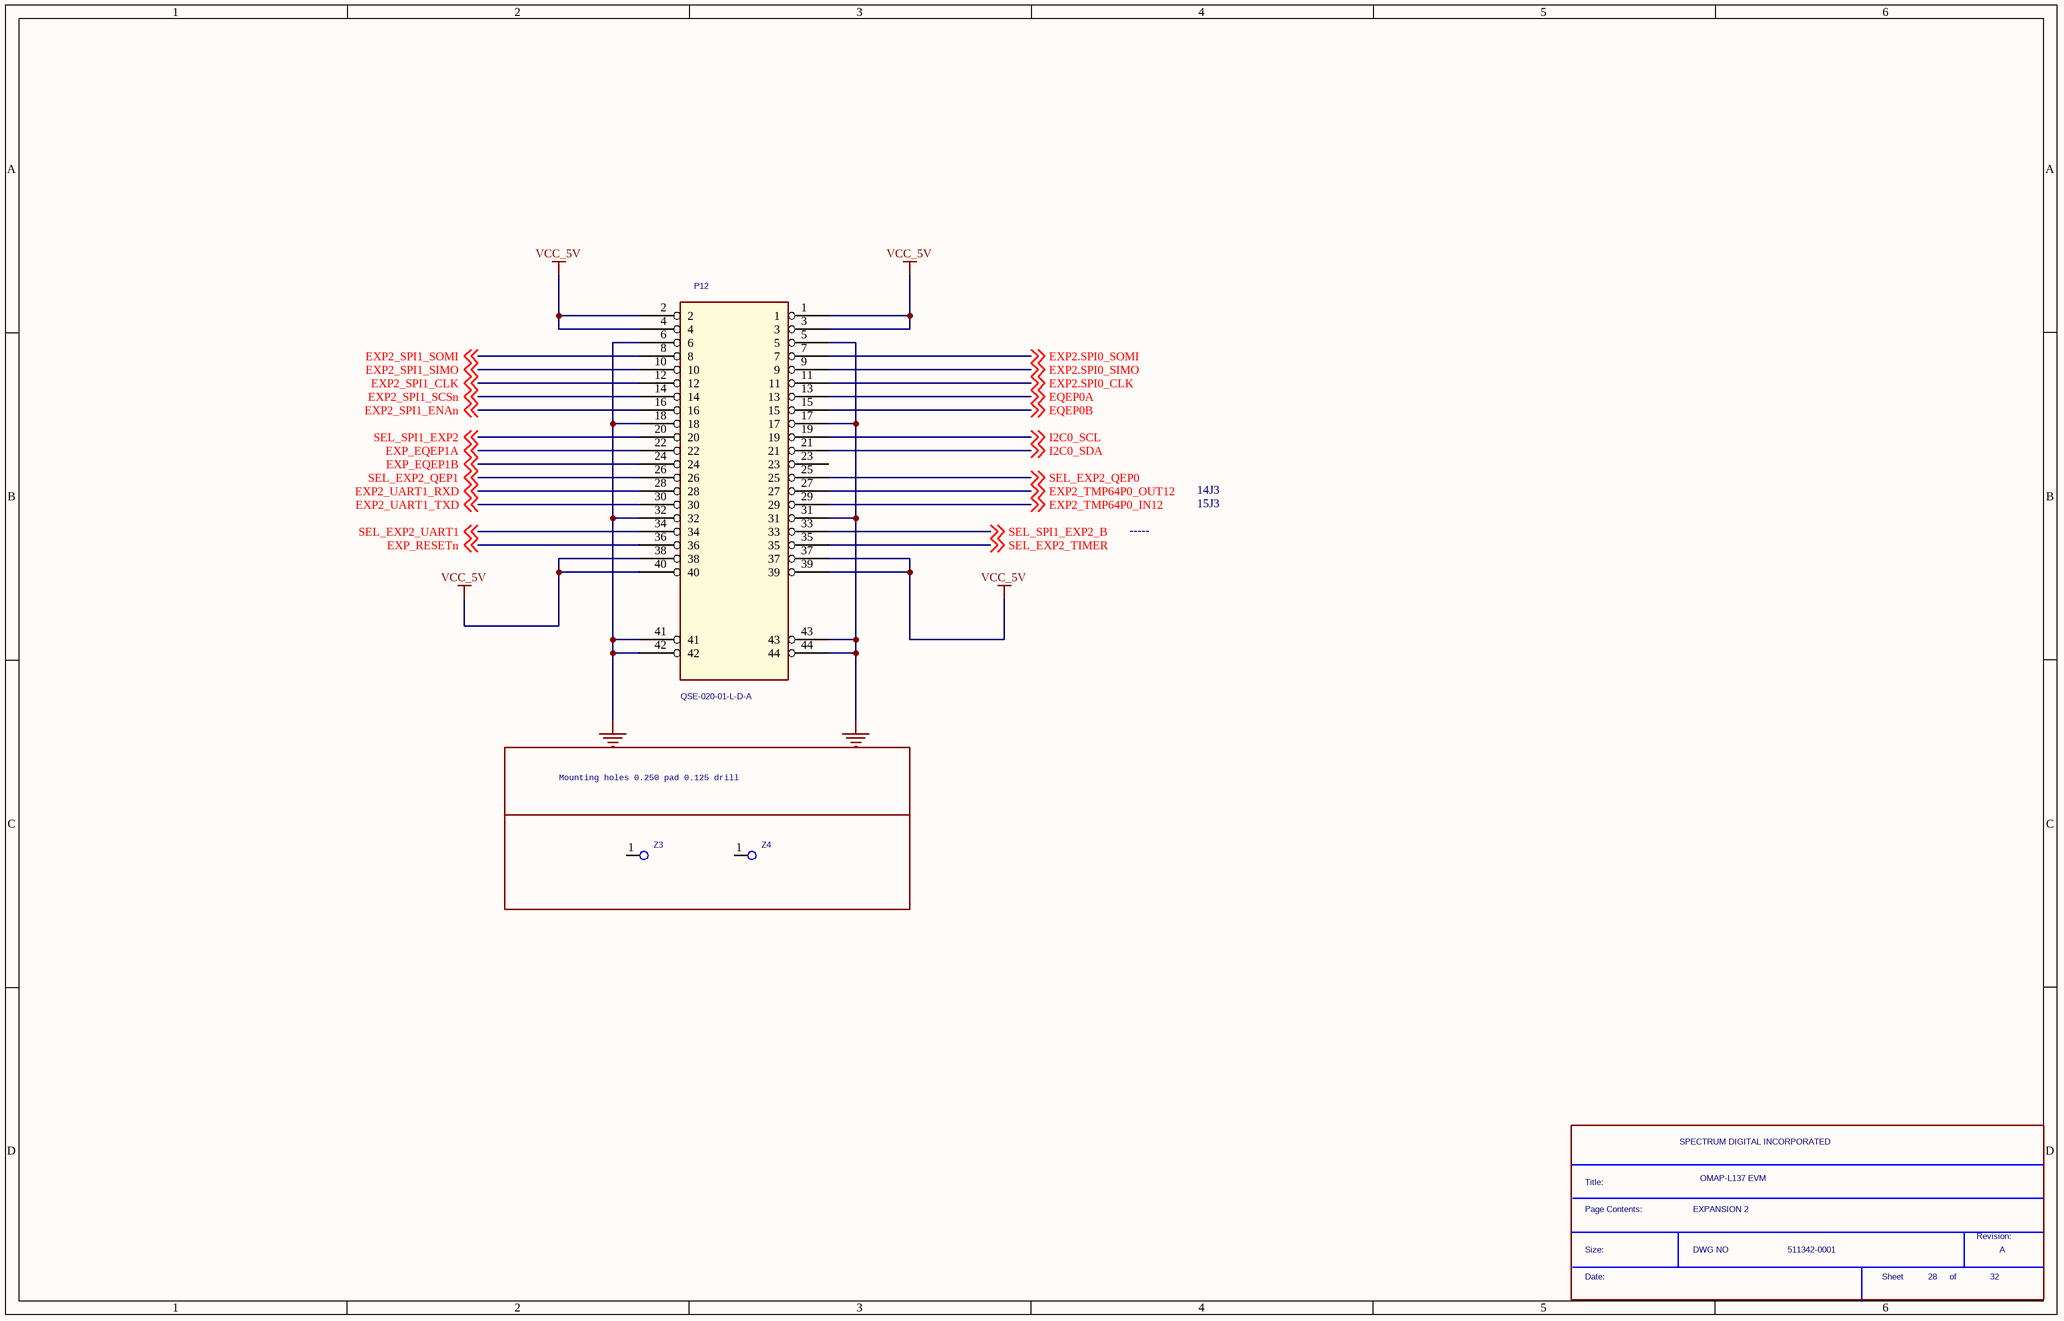
[diagram p4: SH28 - EXPANSION2.SchDoc]

### Parts
(Parts that share a designator on the sheet are numbered #1, #2 ... from top to bottom, then left to right.)
*#5  Page Contents:: EXPANSION 2  RevCode: A  Title: OMAP-L137 EVM  OrgName: SPECTRUM DIGITAL INCORPORATED  Doc: 511342-0001  Page Number: 28  Page Count: 32  (hidden comment: SDTitleBlock)  (graphical)
P12  QSE-020-01-L-D-A  [qse_020]
Z3  MNTHOLE  [TP1_0-2_0]  (value not drawn)
Z4  MNTHOLE  [TP1_0-2_0]  (value not drawn)

### Blocks framed on the sheet
Mounting holes 0.250 pad 0.125 drill: Z3 Z4

### Nets
GND: P12.5 P12.6 P12.17 P12.18 P12.31 P12.32 P12.41 P12.42 P12.43 P12.44
VCC_5V: P12.1 P12.2 P12.3 P12.4 P12.37 P12.38 P12.39 P12.40
EQEP0A: P12.13 ; off-sheet EQEP0A
EQEP0B: P12.15 ; off-sheet EQEP0B
EXP2.SPI0_CLK: P12.11 ; off-sheet EXP2.SPI0_CLK
EXP2.SPI0_SIMO: P12.9 ; off-sheet EXP2.SPI0_SIMO
EXP2.SPI0_SOMI: P12.7 ; off-sheet EXP2.SPI0_SOMI
EXP2_SPI1_CLK: P12.12 ; off-sheet EXP2_SPI1_CLK
EXP2_SPI1_ENAn: P12.16 ; off-sheet EXP2_SPI1_ENAn
EXP2_SPI1_SCSn: P12.14 ; off-sheet EXP2_SPI1_SCSn
EXP2_SPI1_SIMO: P12.10 ; off-sheet EXP2_SPI1_SIMO
EXP2_SPI1_SOMI: P12.8 ; off-sheet EXP2_SPI1_SOMI
EXP2_TMP64P0_IN12: P12.29 ; off-sheet EXP2_TMP64P0_IN12
EXP2_TMP64P0_OUT12: P12.27 ; off-sheet EXP2_TMP64P0_OUT12
EXP2_UART1_RXD: P12.28 ; off-sheet EXP2_UART1_RXD
EXP2_UART1_TXD: P12.30 ; off-sheet EXP2_UART1_TXD
EXP_EQEP1A: P12.22 ; off-sheet EXP_EQEP1A
EXP_EQEP1B: P12.24 ; off-sheet EXP_EQEP1B
EXP_RESETn: P12.36 ; off-sheet EXP_RESETn
I2C0_SCL: P12.19 ; off-sheet I2C0_SCL
I2C0_SDA: P12.21 ; off-sheet I2C0_SDA
SEL_EXP2_QEP0: P12.25 ; off-sheet SEL_EXP2_QEP0
SEL_EXP2_QEP1: P12.26 ; off-sheet SEL_EXP2_QEP1
SEL_EXP2_TIMER: P12.35 ; off-sheet SEL_EXP2_TIMER
SEL_EXP2_UART1: P12.34 ; off-sheet SEL_EXP2_UART1
SEL_SPI1_EXP2: P12.20 ; off-sheet SEL_SPI1_EXP2
SEL_SPI1_EXP2_B: P12.33 ; off-sheet SEL_SPI1_EXP2_B

Not connected (* = marked no-connect by the designer): P12 23; Z3 1; Z4 1

### Notes on the sheet
- -----
- 14J3
- 15J3
- (in symbol SDTitleBlock) Title:; Page Contents:; Revision:; Size:; DWG NO; Date:; Sheet; of

### Library data of the parts
P12 = QSE-020-01-L-D-A_0: Part #: 101881-0020R
Z3 Z4 = TestPoint1: ATLStockNo1: none

## Sheet SH27 - EXPANSION1.SchDoc
size 386 x 246 mm
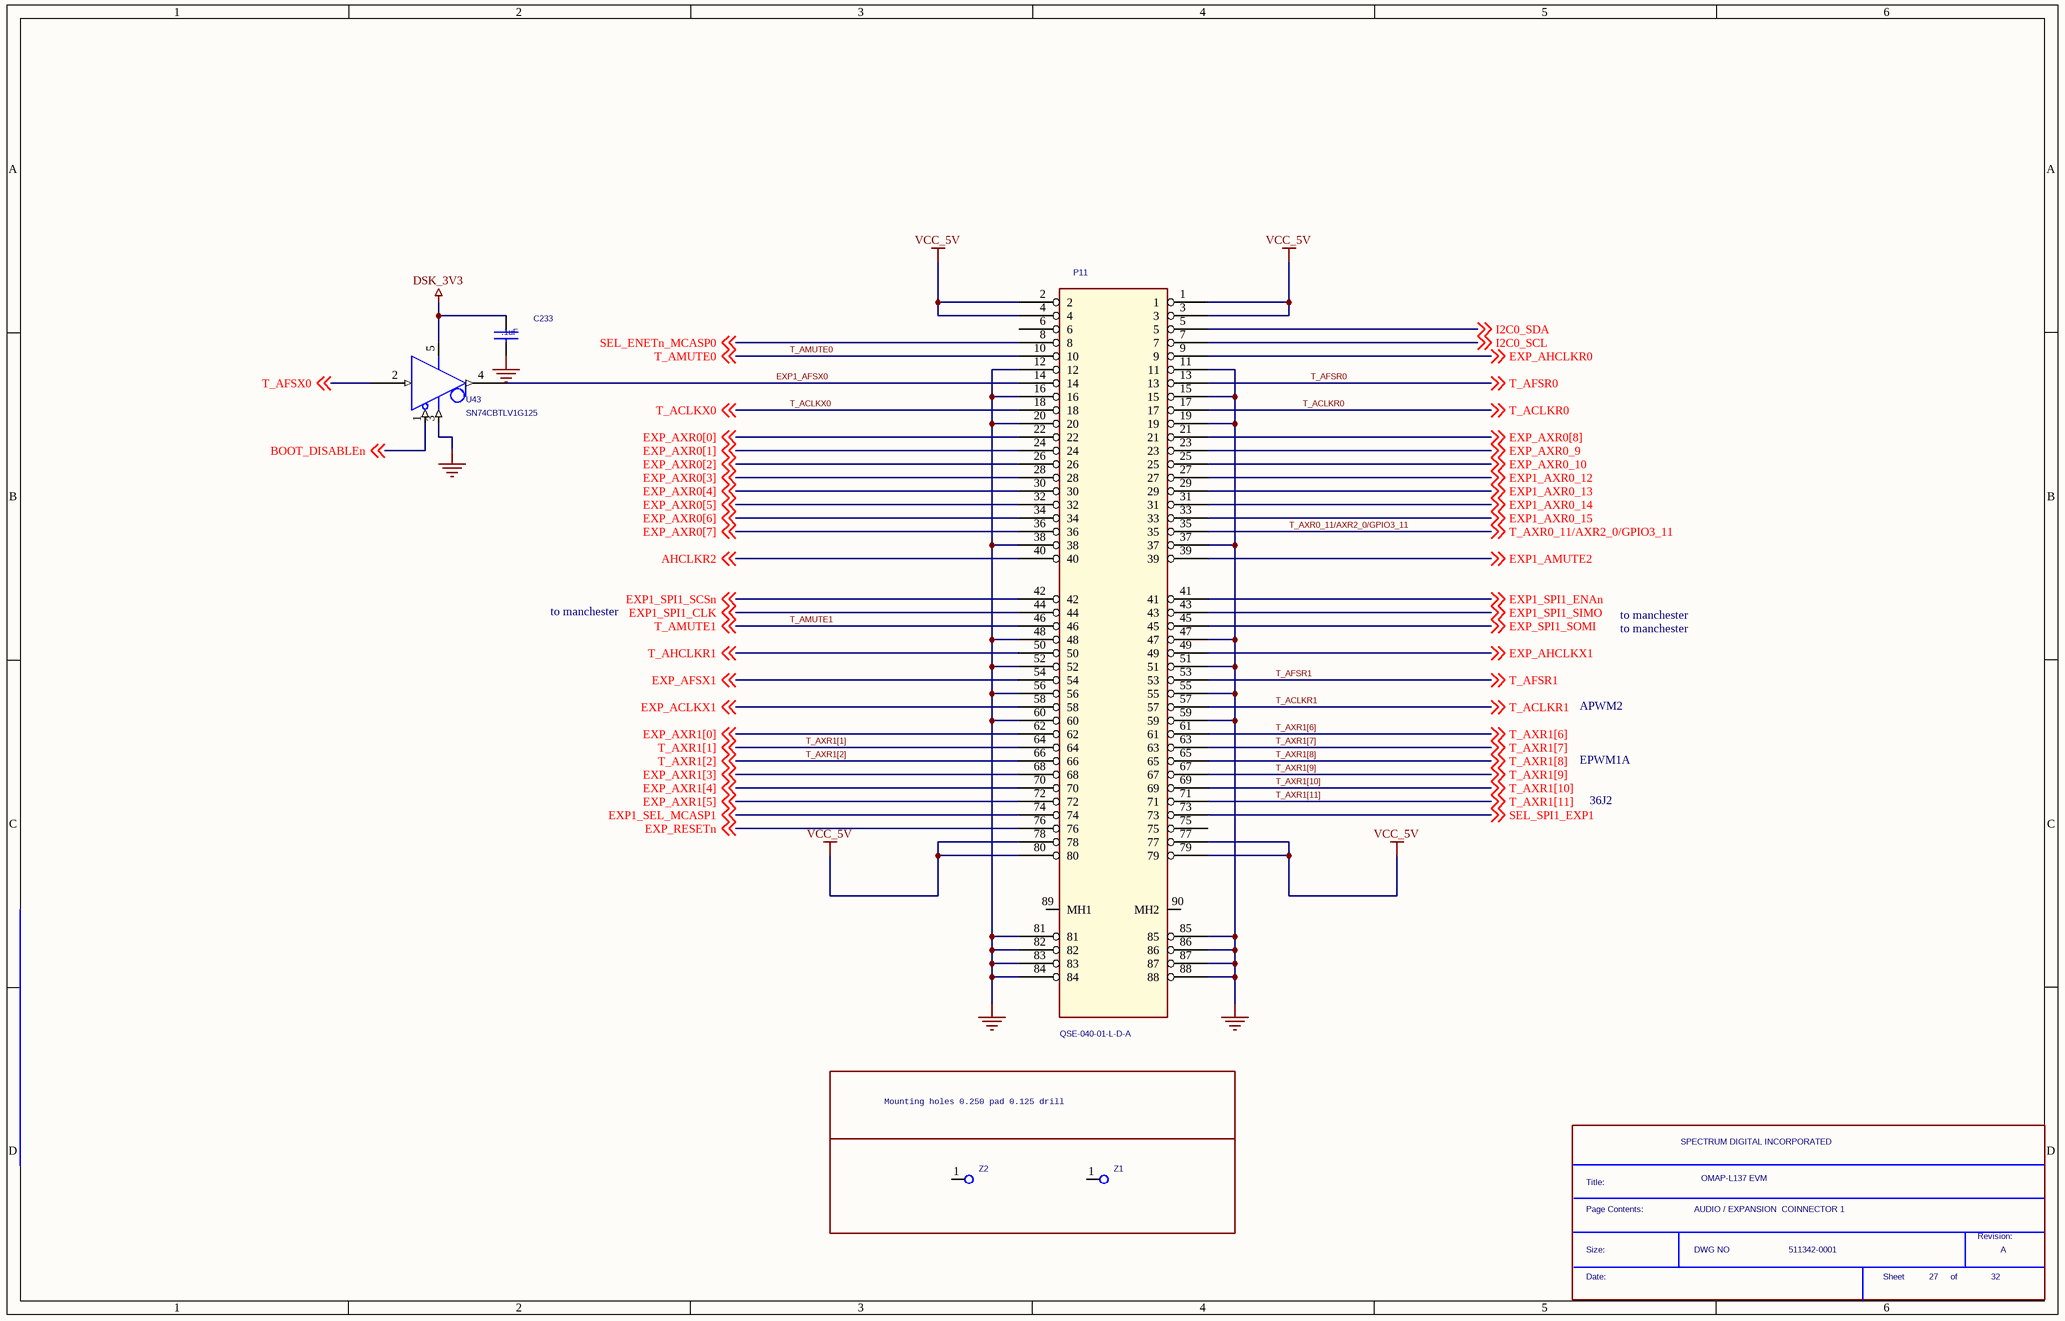
[diagram p5: SH27 - EXPANSION1.SchDoc]

### Parts
(Parts that share a designator on the sheet are numbered #1, #2 ... from top to bottom, then left to right.)
*#6  Page Contents:: AUDIO / EXPANSION  COINNECTOR 1  RevCode: A  Title: OMAP-L137 EVM  OrgName: SPECTRUM DIGITAL INCORPORATED  Doc: 511342-0001  Page Number: 27  Page Count: 32  (hidden comment: SDTitleBlock)  (graphical)
C233  .1uF  [c402-25]
P11  QSE-040-01-L-D-A  [qse_040]
U43  SN74CBTLV1G125  [DCK]
Z1  TestPoint1  [TP1_0-2_0]  (value not drawn)
Z2  MNTHOLE  [TP1_0-2_0]  (value not drawn)

### Blocks framed on the sheet
Mounting holes 0.250 pad 0.125 drill: Z1 Z2

### Nets
DSK_3V3: C233.1 U43.5(VCC)
GND: C233.2 P11.11 P11.12 P11.15 P11.16 P11.19 P11.20 P11.37 P11.38 P11.47 P11.48 P11.51 P11.52 P11.55 P11.56 P11.59 P11.60 P11.81 P11.82 P11.83 P11.84 P11.85 P11.86 P11.87 P11.88 U43.3(GND)
VCC_5V: P11.1 P11.2 P11.3 P11.4 P11.77 P11.78 P11.79 P11.80
AHCLKR2: P11.40 ; off-sheet AHCLKR2
BOOT_DISABLEn: U43.1(OE) ; off-sheet BOOT_DISABLEn
EXP1_AFSX0: P11.14 U43.4(O)
EXP1_AMUTE2: P11.39 ; off-sheet EXP1_AMUTE2
EXP1_AXR0_12: P11.27 ; off-sheet EXP1_AXR0_12
EXP1_AXR0_13: P11.29 ; off-sheet EXP1_AXR0_13
EXP1_AXR0_14: P11.31 ; off-sheet EXP1_AXR0_14
EXP1_AXR0_15: P11.33 ; off-sheet EXP1_AXR0_15
EXP1_SEL_MCASP1: P11.74 ; off-sheet EXP1_SEL_MCASP1
EXP1_SPI1_CLK: P11.44 ; off-sheet EXP1_SPI1_CLK
EXP1_SPI1_ENAn: P11.41 ; off-sheet EXP1_SPI1_ENAn
EXP1_SPI1_SCSn: P11.42 ; off-sheet EXP1_SPI1_SCSn
EXP1_SPI1_SIMO: P11.43 ; off-sheet EXP1_SPI1_SIMO
EXP_ACLKX1: P11.58 ; off-sheet EXP_ACLKX1
EXP_AFSX1: P11.54 ; off-sheet EXP_AFSX1
EXP_AHCLKR0: P11.9 ; off-sheet EXP_AHCLKR0
EXP_AHCLKX1: P11.49 ; off-sheet EXP_AHCLKX1
EXP_AXR0[0]: P11.22 ; off-sheet EXP_AXR0[0]
EXP_AXR0[1]: P11.24 ; off-sheet EXP_AXR0[1]
EXP_AXR0[2]: P11.26 ; off-sheet EXP_AXR0[2]
EXP_AXR0[3]: P11.28 ; off-sheet EXP_AXR0[3]
EXP_AXR0[4]: P11.30 ; off-sheet EXP_AXR0[4]
EXP_AXR0[5]: P11.32 ; off-sheet EXP_AXR0[5]
EXP_AXR0[6]: P11.34 ; off-sheet EXP_AXR0[6]
EXP_AXR0[7]: P11.36 ; off-sheet EXP_AXR0[7]
EXP_AXR0[8]: P11.21 ; off-sheet EXP_AXR0[8]
EXP_AXR0_9: P11.23 ; off-sheet EXP_AXR0_9
EXP_AXR0_10: P11.25 ; off-sheet EXP_AXR0_10
EXP_AXR1[0]: P11.62 ; off-sheet EXP_AXR1[0]
EXP_AXR1[3]: P11.68 ; off-sheet EXP_AXR1[3]
EXP_AXR1[4]: P11.70 ; off-sheet EXP_AXR1[4]
EXP_AXR1[5]: P11.72 ; off-sheet EXP_AXR1[5]
EXP_RESETn: P11.76 ; off-sheet EXP_RESETn
EXP_SPI1_SOMI: P11.45 ; off-sheet EXP_SPI1_SOMI
I2C0_SCL: P11.7 ; off-sheet I2C0_SCL
I2C0_SDA: P11.5 ; off-sheet I2C0_SDA
SEL_ENETn_MCASP0: P11.8 ; off-sheet SEL_ENETn_MCASP0
SEL_SPI1_EXP1: P11.73 ; off-sheet SEL_SPI1_EXP1
T_ACLKR0: P11.17 ; off-sheet T_ACLKR0
T_ACLKR1: P11.57 ; off-sheet T_ACLKR1
T_ACLKX0: P11.18 ; off-sheet T_ACLKX0
T_AFSR0: P11.13 ; off-sheet T_AFSR0
T_AFSR1: P11.53 ; off-sheet T_AFSR1
T_AFSX0: U43.2(I) ; off-sheet T_AFSX0
T_AHCLKR1: P11.50 ; off-sheet T_AHCLKR1
T_AMUTE0: P11.10 ; off-sheet T_AMUTE0
T_AMUTE1: P11.46 ; off-sheet T_AMUTE1
T_AXR0_11/AXR2_0/GPIO3_11: P11.35 ; off-sheet T_AXR0_11/AXR2_0/GPIO3_11
T_AXR1[1]: P11.64 ; off-sheet T_AXR1[1]
T_AXR1[2]: P11.66 ; off-sheet T_AXR1[2]
T_AXR1[6]: P11.61 ; off-sheet T_AXR1[6]
T_AXR1[7]: P11.63 ; off-sheet T_AXR1[7]
T_AXR1[8]: P11.65 ; off-sheet T_AXR1[8]
T_AXR1[9]: P11.67 ; off-sheet T_AXR1[9]
T_AXR1[10]: P11.69 ; off-sheet T_AXR1[10]
T_AXR1[11]: P11.71 ; off-sheet T_AXR1[11]

Not connected (* = marked no-connect by the designer): P11 6 75 89(MH1) 90(MH2); Z1 1; Z2 1

### Notes on the sheet
- to manchester
- APWM2
- EPWM1A
- 36J2
- (in symbol SDTitleBlock) Title:; Page Contents:; Revision:; Size:; DWG NO; Date:; Sheet; of

### Library data of the parts
C233 = CAP NP_2: Part #: 101587-1100R
P11 = QSE-040-01-L-D-A: Part #: 101881-0040R
U43 = SN74LVC1G125: Part #: 101689-0125R
Z1 Z2 = TestPoint1: ATLStockNo1: none

## Sheet SH26 - ENET PORTS.SchDoc
size 386 x 246 mm
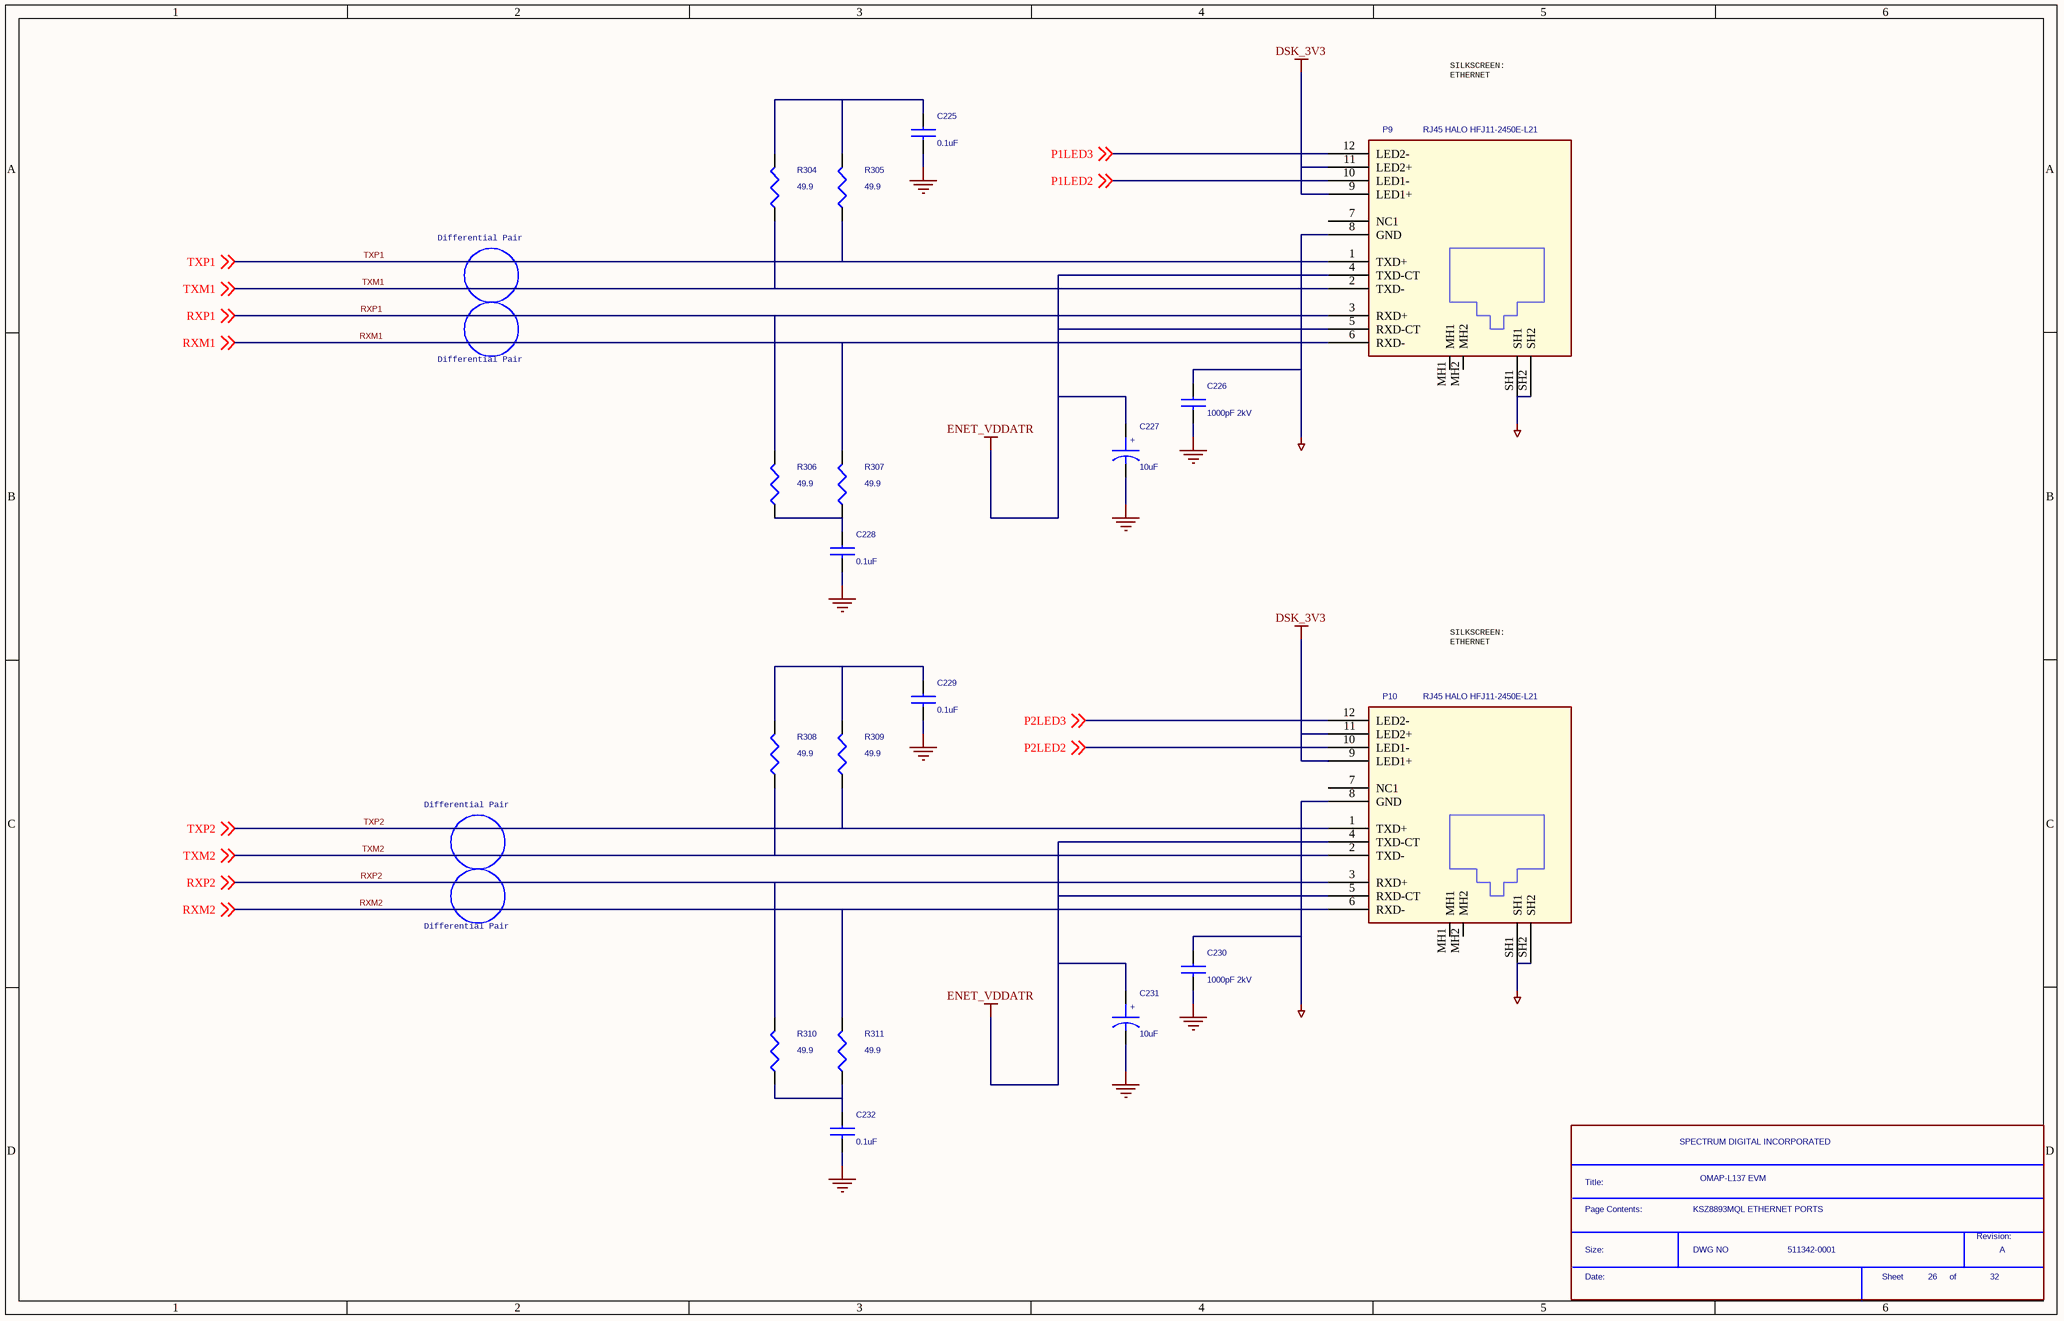
[diagram p6: SH26 - ENET PORTS.SchDoc]

### Parts
(Parts that share a designator on the sheet are numbered #1, #2 ... from top to bottom, then left to right.)
*#7  Page Contents:: KSZ8893MQL ETHERNET PORTS  RevCode: A  Title: OMAP-L137 EVM  OrgName: SPECTRUM DIGITAL INCORPORATED  Doc: 511342-0001  Page Number: 26  Page Count: 32  (hidden comment: SDTitleBlock)  (graphical)
C225  0.1uF  [c402-25]
C226  1000pF 2kV  [EIA1812]
C227  10uF  [c1206-40x70-POL]
C228  0.1uF  [c402-25]
C229  0.1uF  [c402-25]
C230  1000pF 2kV  [EIA1812]
C231  10uF  [c1206-40x70-POL]
C232  0.1uF  [c402-25]
P9  RJ45 HALO HFJ11-2450E-L21  [RJ45AMP556591-1]
P10  RJ45 HALO HFJ11-2450E-L21  [RJ45AMP556591-1]
R304  49.9  [r603-35x45]
R305  49.9  [r603-35x45]
R306  49.9  [r603-35x45]
R307  49.9  [r603-35x45]
R308  49.9  [r603-35x45]
R309  49.9  [r603-35x45]
R310  49.9  [r603-35x45]
R311  49.9  [r603-35x45]

### Nets
DSK_3V3: P9.9(LED1+) P9.11(LED2+) P10.9(LED1+) P10.11(LED2+)
ENET_VDDATR: C227.1 C231.1 P9.4(TXD-CT) P9.5(RXD-CT) P10.4(TXD-CT) P10.5(RXD-CT)
GND: C225.2 C226.2 C227.2 C228.2 C229.2 C230.2 C231.2 C232.2
GND_E_ENET: C226.1 C230.1 P9.8(GND) P9.SH1 P9.SH2 P10.8(GND) P10.SH1 P10.SH2
P1LED2: P9.10(LED1-) ; off-sheet P1LED2
P1LED3: P9.12(LED2-) ; off-sheet P1LED3
P2LED2: P10.10(LED1-) ; off-sheet P2LED2
P2LED3: P10.12(LED2-) ; off-sheet P2LED3
RXM1: P9.6(RXD-) R307.2 ; off-sheet RXM1
RXM2: P10.6(RXD-) R311.2 ; off-sheet RXM2
RXP1: P9.3(RXD+) R306.2 ; off-sheet RXP1
RXP2: P10.3(RXD+) R310.2 ; off-sheet RXP2
TXM1: P9.2(TXD-) R304.1 ; off-sheet TXM1
TXM2: P10.2(TXD-) R308.1 ; off-sheet TXM2
TXP1: P9.1(TXD+) R305.1 ; off-sheet TXP1
TXP2: P10.1(TXD+) R309.1 ; off-sheet TXP2
NetC225_1: C225.1 R304.2 R305.2
NetC228_1: C228.1 R306.1 R307.1
NetC229_1: C229.1 R308.2 R309.2
NetC232_1: C232.1 R310.1 R311.1

Not connected (* = marked no-connect by the designer): P9 7(NC1) MH1 MH2; P10 7(NC1) MH1 MH2

### Notes on the sheet
- SILKSCREEN:
  ETHERNET
- Differential Pair
- (in symbol CAPACITOR POL_0) +
- (in symbol SDTitleBlock) Title:; Page Contents:; Revision:; Size:; DWG NO; Date:; Sheet; of

### Library data of the parts
C225 C228 C229 C232 = CAP NP: Part #: 101587-1100R
C226 C230 = CAP NP: Part #: 101583-1102R
C227 C231 = CAPACITOR POL_0: Part #: 101003-0101R
P9 P10 = RJ45_2: RJ45 Jack with 2 LEDs shielded; NCPartnumber: 2J0005; Mfr: Amphenol; PartName: RJ45w2LEDs; Part #: 102166-0001R; Cost100: 2.31; Vendor: Newark; Cost10K: 1.87; MfrNum: RJHS-5385
R304-R311 = RESISTOR: Part #: 100642-4990R

## Sheet SH25 - ENET- POWER.SchDoc
size 386 x 246 mm
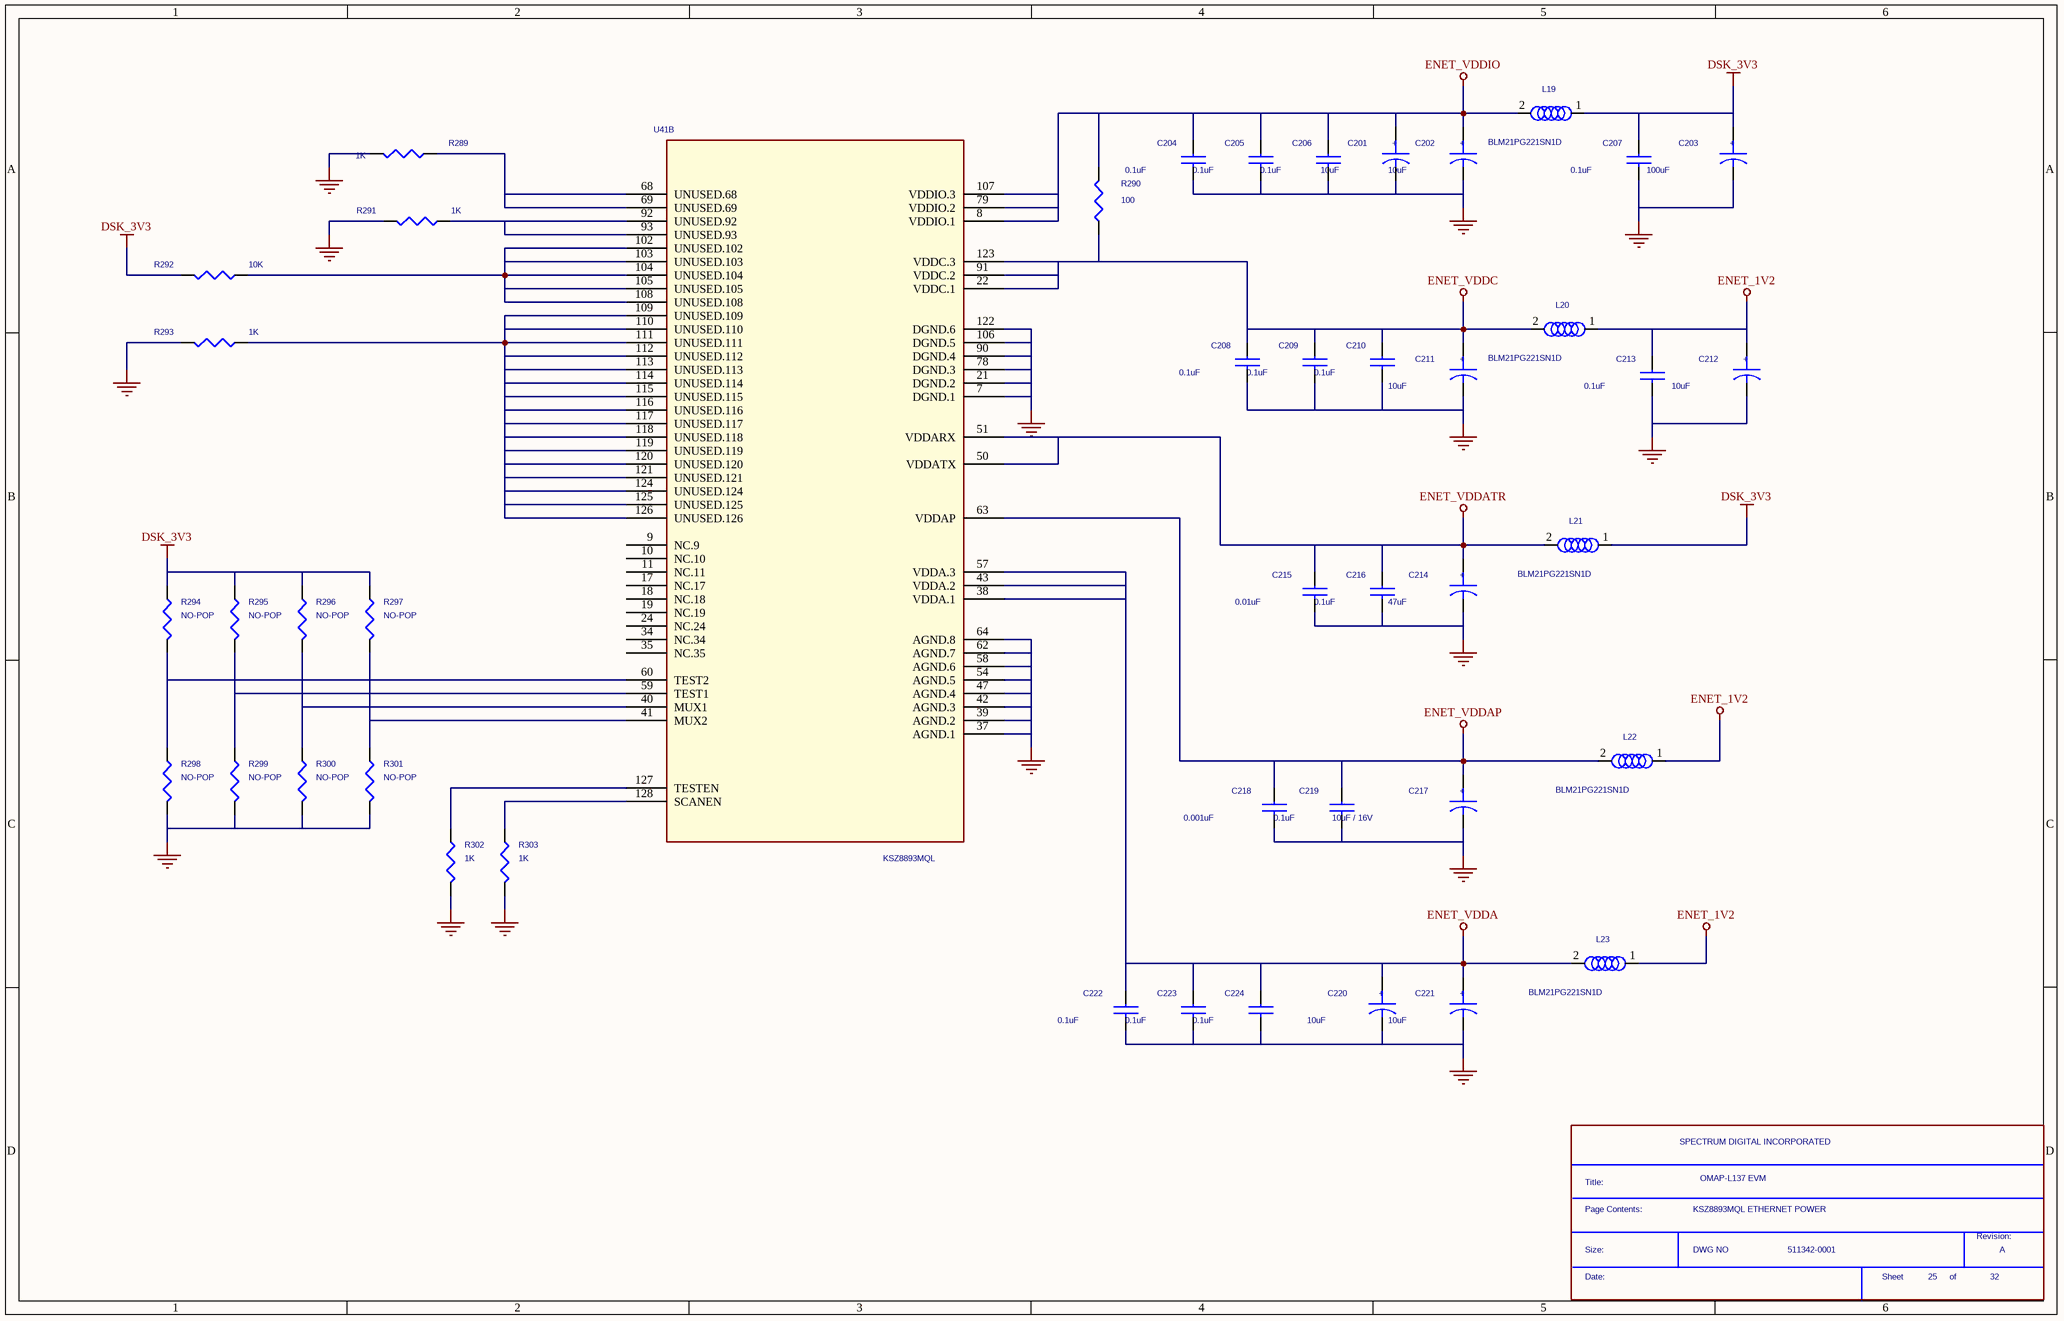
[diagram p7: SH25 - ENET- POWER.SchDoc]

### Parts
(Parts that share a designator on the sheet are numbered #1, #2 ... from top to bottom, then left to right.)
*#8  Page Contents:: KSZ8893MQL ETHERNET POWER  RevCode: A  Title: OMAP-L137 EVM  OrgName: SPECTRUM DIGITAL INCORPORATED  Doc: 511342-0001  Page Number: 25  Page Count: 32  (hidden comment: SDTitleBlock)  (graphical)
C201  10uF  [c1206-40x70-POL]
C202  10uF  [c1206-40x70-POL]
C203  100uF  [c7343-84x118]
C204  0.1uF  [c402-25]
C205  0.1uF  [c402-25]
C206  0.1uF  [c402-25]
C207  0.1uF  [c402-25]
C208  0.1uF  [c402-25]
C209  0.1uF  [c402-25]
C210  0.1uF  [c402-25]
C211  10uF  [c1206-40x70-POL]
C212  10uF  [c1206-40x70-POL]
C213  0.1uF  [c402-25]
C214  47uF  [c7343-84x118]
C215  0.01uF  [c402-25]
C216  0.1uF  [c402-25]
C217  10uF / 16V  [c1206-40x70-POL]
C218  0.001uF  [c402-25]
C219  0.1uF  [c402-25]
C220  10uF  [c1206-40x70-POL]
C221  10uF  [c1206-40x70-POL]
C222  0.1uF  [c402-25]
C223  0.1uF  [c402-25]
C224  0.1uF  [c402-25]
L19  BLM21PG221SN1D  [l805-35x60]
L20  BLM21PG221SN1D  [l805-35x60]
L21  BLM21PG221SN1D  [l805-35x60]
L22  BLM21PG221SN1D  [l805-35x60]
L23  BLM21PG221SN1D  [l805-35x60]
R289  1K  [r402-25]
R290  100  [r603-35x45]
R291  1K  [r402-25]
R292  10K  [r402-25]
R293  1K  [r402-25]
R294  NO-POP  [r402-25]
R295  NO-POP  [r402-25]
R296  NO-POP  [r402-25]
R297  NO-POP  [r402-25]
R298  NO-POP  [r402-25]
R299  NO-POP  [r402-25]
R300  NO-POP  [r402-25]
R301  NO-POP  [r402-25]
R302  1K  [r402-25]
R303  1K  [r402-25]
U41  KSZ8893MQL  [pqfp128rec-12x70]  (part B of 2)

### Nets
DSK_3V3: C203.1 C207.1 L19.1 L21.1 R292.2 R294.1 R295.1 R296.1 R297.1
ENET_1V2: C212.1 C213.1 L20.1 L22.1 L23.1
ENET_VDDA: C220.1 C221.1 C222.1 C223.1 C224.1 L23.2 U41.38(VDDA.1) U41.43(VDDA.2) U41.57(VDDA.3)
ENET_VDDAP: C217.1 C218.1 C219.1 L22.2 U41.63(VDDAP)
ENET_VDDATR: C214.1 C215.1 C216.1 L21.2 U41.50(VDDATX) U41.51(VDDARX)
ENET_VDDC: C208.1 C209.1 C210.1 C211.1 L20.2 R290.1 U41.22(VDDC.1) U41.91(VDDC.2) U41.123(VDDC.3)
ENET_VDDIO: C201.1 C202.1 C204.1 C205.1 C206.1 L19.2 R290.2 U41.8(VDDIO.1) U41.79(VDDIO.2) U41.107(VDDIO.3)
GND: C201.2 C202.2 C203.2 C204.2 C205.2 C206.2 C207.2 C208.2 C209.2 C210.2 C211.2 C212.2 C213.2 C214.2 C215.2 C216.2 C217.2 C218.2 C219.2 C220.2 C221.2 C222.2 C223.2 C224.2 R289.1 R291.2 R293.2 R298.2 R299.2 R300.2 R301.2 R302.2 R303.2 U41.7(DGND.1) U41.21(DGND.2) U41.37(AGND.1) U41.39(AGND.2) U41.42(AGND.3) U41.47(AGND.4) U41.54(AGND.5) U41.58(AGND.6) U41.62(AGND.7) U41.64(AGND.8) U41.78(DGND.3) U41.90(DGND.4) U41.106(DGND.5) U41.122(DGND.6)
NetR289_2: R289.2 U41.68(UNUSED.68) U41.69(UNUSED.69)
NetR291_1: R291.1 U41.92(UNUSED.92) U41.93(UNUSED.93)
NetR292_1: R292.1 U41.102(UNUSED.102) U41.103(UNUSED.103) U41.104(UNUSED.104) U41.105(UNUSED.105) U41.108(UNUSED.108)
NetR293_1: R293.1 U41.109(UNUSED.109) U41.110(UNUSED.110) U41.111(UNUSED.111) U41.112(UNUSED.112) U41.113(UNUSED.113) U41.114(UNUSED.114) U41.115(UNUSED.115) U41.116(UNUSED.116) U41.117(UNUSED.117) U41.118(UNUSED.118) U41.119(UNUSED.119) U41.120(UNUSED.120) U41.121(UNUSED.121) U41.124(UNUSED.124) U41.125(UNUSED.125) U41.126(UNUSED.126)
NetR294_2: R294.2 R298.1 U41.60(TEST2)
NetR295_2: R295.2 R299.1 U41.59(TEST1)
NetR296_2: R296.2 R300.1 U41.40(MUX1)
NetR297_2: R297.2 R301.1 U41.41(MUX2)
NetR302_1: R302.1 U41.127(TESTEN)
NetR303_1: R303.1 U41.128(SCANEN)

Not connected (* = marked no-connect by the designer): U41 9(NC.9) 10(NC.10) 11(NC.11) 17(NC.17) 18(NC.18) 19(NC.19) 24(NC.24) 34(NC.34) 35(NC.35)

### Notes on the sheet
- (in symbol CAPACITOR POL_0) +
- (in symbol SDTitleBlock) Title:; Page Contents:; Revision:; Size:; DWG NO; Date:; Sheet; of

### Library data of the parts
C201 C202 C211 C212 C217 C220 C221 = CAPACITOR POL_0: Part #: 101003-0101R
C203 = CAPACITOR POL_0: Part #: 101608-0102R
C204-C210 C213 C216 C219 C222-C224 = CAP NP: Part #: 101587-1100R
C214 = CAPACITOR POL_0: Part #: 100995-0471R
C215 = CAP NP: Part #: 101587-1101R
C218 = CAP NP: Part #: 102058-1102R
L19-L23 = FBEAD_1: Part Number: IND-FBD-01; Part #: 101228-2201R; Part Type: Inductor
R289 R291 R293 R302 R303 = RESISTOR_0: Part #: 101370-1002R
R290 = R: Part #: 100642-1001R
R292 = RESISTOR_0: Part #: 101370-1003R
R294-R301 = RESISTOR_0: Part #: R0402-NOPOP
U41 = KS8995_multi_0: Part #: 102795-0001R

## Sheet SH24 - ENET PHY.SchDoc
size 386 x 246 mm
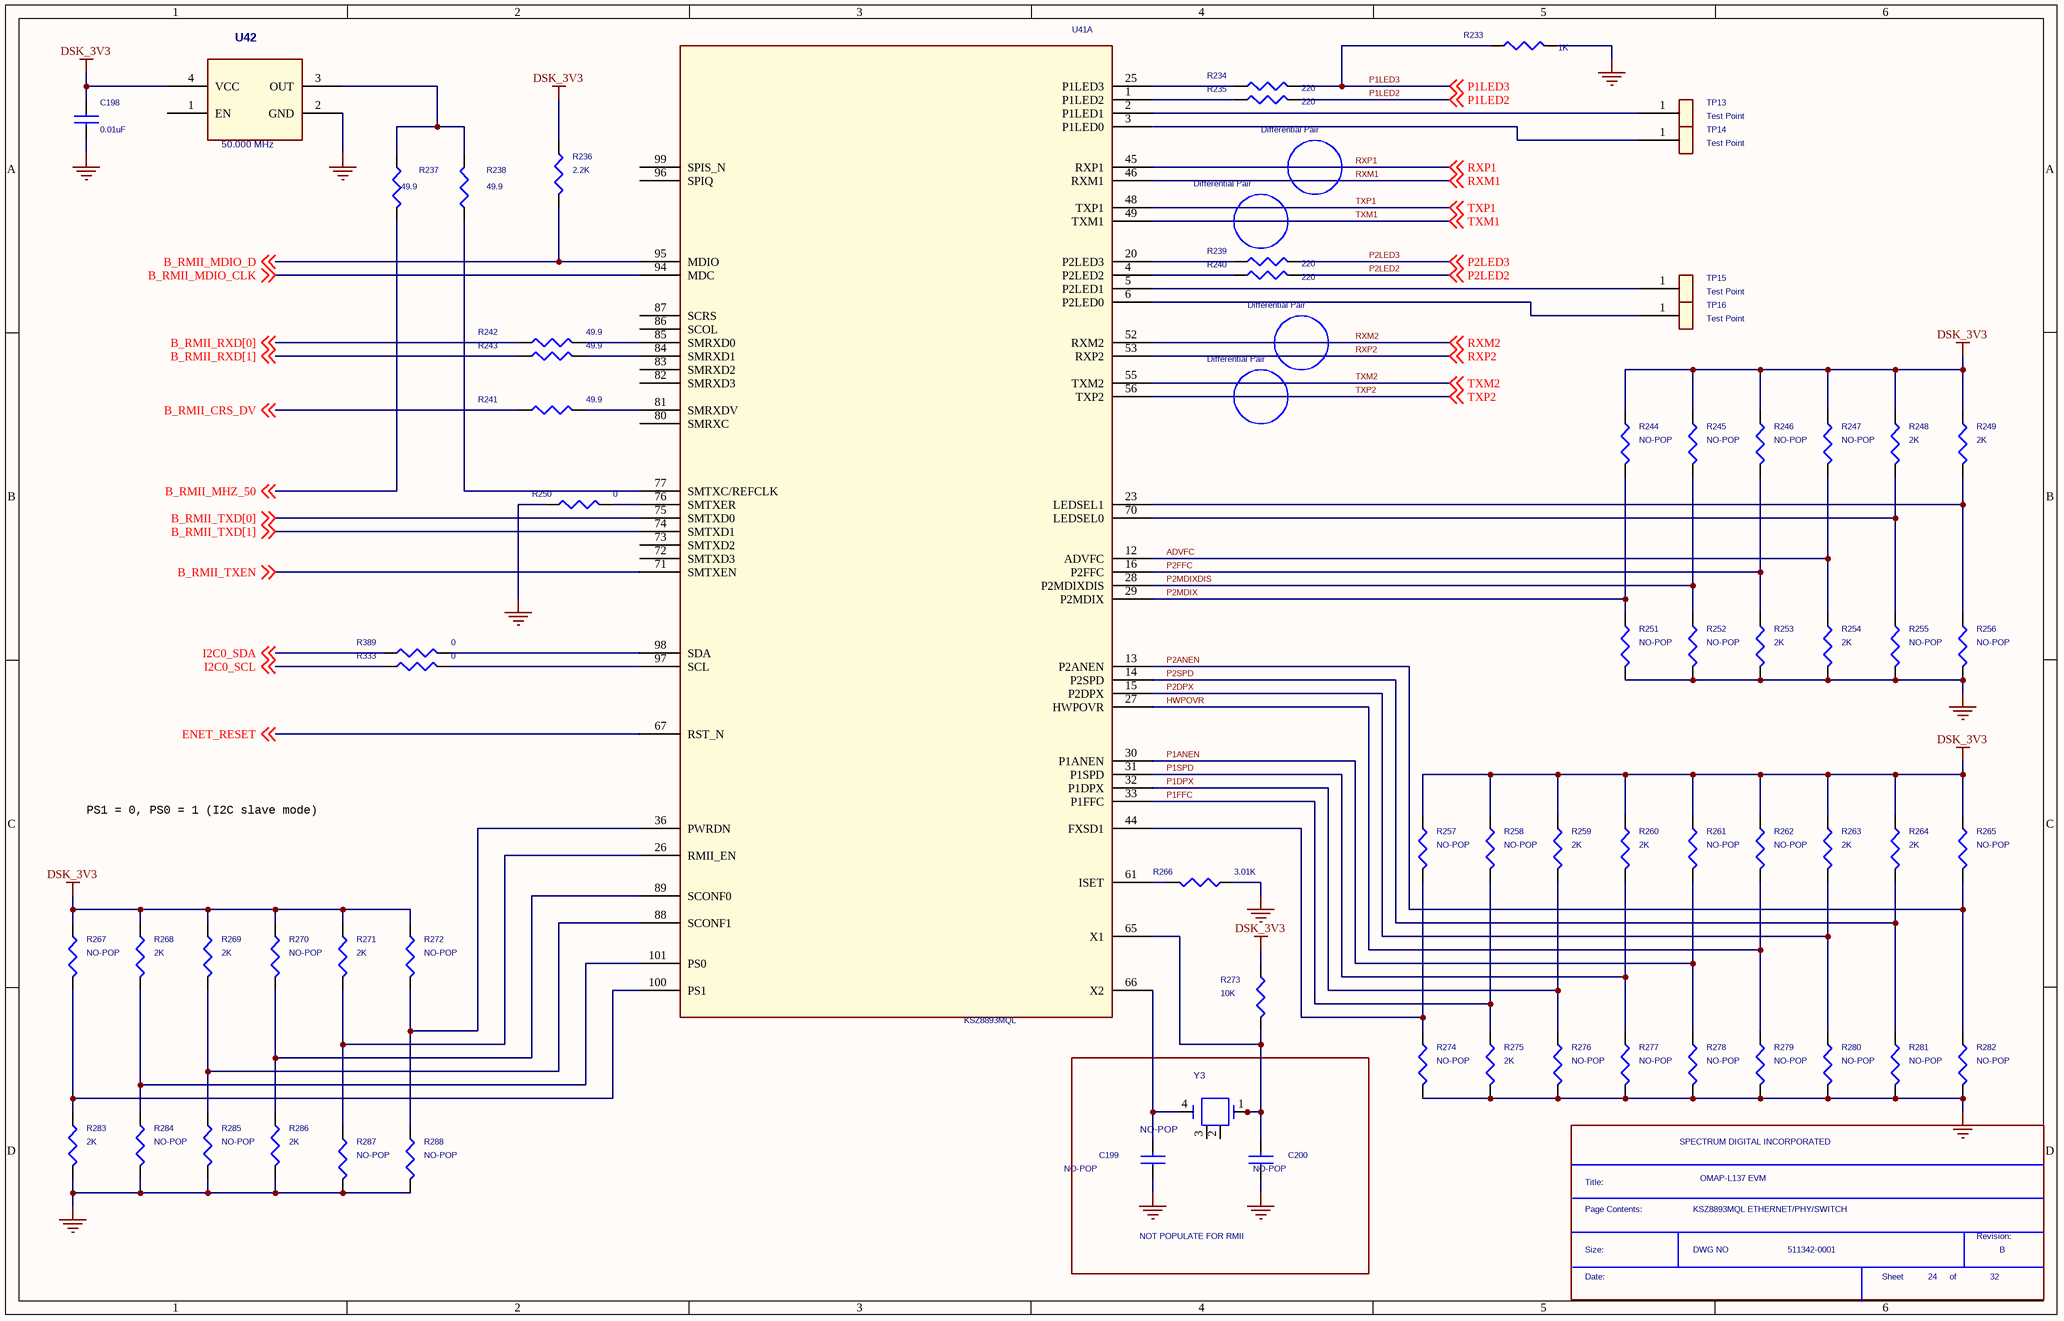
[diagram p8: SH24 - ENET PHY.SchDoc]

### Parts
(Parts that share a designator on the sheet are numbered #1, #2 ... from top to bottom, then left to right.)
*#9  Page Contents:: KSZ8893MQL ETHERNET/PHY/SWITCH  RevCode: B  Title: OMAP-L137 EVM  OrgName: SPECTRUM DIGITAL INCORPORATED  Doc: 511342-0001  Page Number: 24  Page Count: 32  (hidden comment: SDTitleBlock)  (graphical)
C198  0.01uF  [c402-25]
C199  NO-POP  [c603-35x45]
C200  NO-POP  [c603-35x45]
R233  1K  [r402-25]
R234  220  [r402-25]
R235  220  [r402-25]
R236  2.2K  [r402-25]
R237  49.9  [r603-35x45]
R238  49.9  [r603-35x45]
R239  220  [r402-25]
R240  220  [r402-25]
R241  49.9  [r603-35x45]
R242  49.9  [r603-35x45]
R243  49.9  [r603-35x45]
R244  NO-POP  [r402-25]
R245  NO-POP  [r402-25]
R246  NO-POP  [r402-25]
R247  NO-POP  [r402-25]
R248  2K  [r402-25]
R249  2K  [r402-25]
R250  0  [r402-25]
R251  NO-POP  [r402-25]
R252  NO-POP  [r402-25]
R253  2K  [r402-25]
R254  2K  [r402-25]
R255  NO-POP  [r402-25]
R256  NO-POP  [r402-25]
R257  NO-POP  [r402-25]
R258  NO-POP  [r402-25]
R259  2K  [r402-25]
R260  2K  [r402-25]
R261  NO-POP  [r402-25]
R262  NO-POP  [r402-25]
R263  2K  [r402-25]
R264  2K  [r402-25]
R265  NO-POP  [r402-25]
R266  3.01K  [r603-35x45]
R267  NO-POP  [r402-25]
R268  2K  [r402-25]
R269  2K  [r402-25]
R270  NO-POP  [r402-25]
R271  2K  [r402-25]
R272  NO-POP  [r402-25]
R273  10K  [r402-25]
R274  NO-POP  [r402-25]
R275  2K  [r402-25]
R276  NO-POP  [r402-25]
R277  NO-POP  [r402-25]
R278  NO-POP  [r402-25]
R279  NO-POP  [r402-25]
R280  NO-POP  [r402-25]
R281  NO-POP  [r402-25]
R282  NO-POP  [r402-25]
R283  2K  [r402-25]
R284  NO-POP  [r402-25]
R285  NO-POP  [r402-25]
R286  2K  [r402-25]
R287  NO-POP  [r402-25]
R288  NO-POP  [r402-25]
R333  0  [r402-25]
R389  0  [r402-25]
TP13  Test Point  [tp1-6040]
TP14  Test Point  [tp1-6040]
TP15  Test Point  [tp1-6040]
TP16  Test Point  [tp1-6040]
U41  KSZ8893MQL  [pqfp128rec-12x70]  (part A of 2)
U42  50.000 MHz  [OSC4-71X79]
Y3  NO-POP  [xtal2-75x94]

### Blocks framed on the sheet
NOT POPULATE FOR RMII: C199 C200 Y3

### Nets
DSK_3V3: C198.1 R236.1 R244.1 R245.1 R246.1 R247.1 R248.1 R249.1 R257.1 R258.1 R259.1 R260.1 R261.1 R262.1 R263.1 R264.1 R265.1 R267.1 R268.1 R269.1 R270.1 R271.1 R272.1 R273.1 U42.4(VCC)
GND: C198.2 C199.1 C200.1 R233.1 R250.1 R251.2 R252.2 R253.2 R254.2 R255.2 R256.2 R266.1 R274.2 R275.2 R276.2 R277.2 R278.2 R279.2 R280.2 R281.2 R282.2 R283.2 R284.2 R285.2 R286.2 R287.2 R288.2 U42.2(GND)
ADVFC: R247.2 R254.1 U41.12(ADVFC)
B_RMII_CRS_DV: R241.1 ; off-sheet B_RMII_CRS_DV
B_RMII_MDIO_CLK: U41.94(MDC) ; off-sheet B_RMII_MDIO_CLK
B_RMII_MDIO_D: R236.2 U41.95(MDIO) ; off-sheet B_RMII_MDIO_D
B_RMII_MHZ_50: R237.1 ; off-sheet B_RMII_MHZ_50
B_RMII_RXD[0]: R242.1 ; off-sheet B_RMII_RXD[0]
B_RMII_RXD[1]: R243.1 ; off-sheet B_RMII_RXD[1]
B_RMII_TXD[0]: U41.75(SMTXD0) ; off-sheet B_RMII_TXD[0]
B_RMII_TXD[1]: U41.74(SMTXD1) ; off-sheet B_RMII_TXD[1]
B_RMII_TXEN: U41.71(SMTXEN) ; off-sheet B_RMII_TXEN
ENET_RESET: U41.67(RST_N) ; off-sheet ENET_RESET
HWPOVR: R262.2 R279.1 U41.27(HWPOVR)
I2C0_SCL: R333.1 ; off-sheet I2C0_SCL
I2C0_SDA: R389.1 ; off-sheet I2C0_SDA
P1ANEN: R261.2 R278.1 U41.30(P1ANEN)
P1DPX: R259.2 R276.1 U41.32(P1DPX)
P1FFC: R258.2 R275.1 U41.33(P1FFC)
P1LED2: R235.1 ; off-sheet P1LED2
P1LED3: R233.2 R234.1 ; off-sheet P1LED3
P1SPD: R260.2 R277.1 U41.31(P1SPD)
P2ANEN: R265.2 R282.1 U41.13(P2ANEN)
P2DPX: R263.2 R280.1 U41.15(P2DPX)
P2FFC: R246.2 R253.1 U41.16(P2FFC)
P2LED2: R240.1 ; off-sheet P2LED2
P2LED3: R239.1 ; off-sheet P2LED3
P2MDIX: R244.2 R251.1 U41.29(P2MDIX)
P2MDIXDIS: R245.2 R252.1 U41.28(P2MDIXDIS)
P2SPD: R264.2 R281.1 U41.14(P2SPD)
RXM1: U41.46(RXM1) ; off-sheet RXM1
RXM2: U41.52(RXM2) ; off-sheet RXM2
RXP1: U41.45(RXP1) ; off-sheet RXP1
RXP2: U41.53(RXP2) ; off-sheet RXP2
TXM1: U41.49(TXM1) ; off-sheet TXM1
TXM2: U41.55(TXM2) ; off-sheet TXM2
TXP1: U41.48(TXP1) ; off-sheet TXP1
TXP2: U41.56(TXP2) ; off-sheet TXP2
NetC199_2: C199.2 U41.66(X2) Y3.4
NetC200_2: C200.2 R273.2 U41.65(X1) Y3.1
NetR234_2: R234.2 U41.25(P1LED3)
NetR235_2: R235.2 U41.1(P1LED2)
NetR237_2: R237.2 R238.2 U42.3(OUT)
NetR238_1: R238.1 U41.77(SMTXC/REFCLK)
NetR239_2: R239.2 U41.20(P2LED3)
NetR240_2: R240.2 U41.4(P2LED2)
NetR241_2: R241.2 U41.81(SMRXDV)
NetR242_2: R242.2 U41.85(SMRXD0)
NetR243_2: R243.2 U41.84(SMRXD1)
NetR248_2: R248.2 R255.1 U41.70(LEDSEL0)
NetR249_2: R249.2 R256.1 U41.23(LEDSEL1)
NetR250_2: R250.2 U41.76(SMTXER)
NetR257_2: R257.2 R274.1 U41.44(FXSD1)
NetR266_2: R266.2 U41.61(ISET)
NetR267_2: R267.2 R283.1 U41.100(PS1)
NetR268_2: R268.2 R284.1 U41.101(PS0)
NetR269_2: R269.2 R285.1 U41.88(SCONF1)
NetR270_2: R270.2 R286.1 U41.89(SCONF0)
NetR271_2: R271.2 R287.1 U41.26(RMII_EN)
NetR272_2: R272.2 R288.1 U41.36(PWRDN)
NetR333_2: R333.2 U41.97(SCL)
NetR389_2: R389.2 U41.98(SDA)
NetTP13_1: TP13.1 U41.2(P1LED1)
NetTP14_1: TP14.1 U41.3(P1LED0)
NetTP15_1: TP15.1 U41.5(P2LED1)
NetTP16_1: TP16.1 U41.6(P2LED0)

Not connected (* = marked no-connect by the designer): U41 72(SMTXD3) 73(SMTXD2) 80(SMRXC) 82(SMRXD3) 83(SMRXD2) 86(SCOL) 87(SCRS) 96(SPIQ) 99(SPIS_N); U42 1(EN); Y3 2 3

### Notes on the sheet
- Differential Pair
- PS1 = 0, PS0 = 1 (I2C slave mode)
- (in symbol SDTitleBlock) Title:; Page Contents:; Revision:; Size:; DWG NO; Date:; Sheet; of

### Library data of the parts
C198 = CAP NP: Part #: 101587-1101R
C199 C200 = CAP NP: Part # Alt: 101002-1224R; Part #: C0603-NOPOP
R233 = RESISTOR_0: Part #: 101370-1002R
R234 R235 R239 R240 = RESISTOR_0: Part #: 101370-2201R
R236 = RESISTOR_0: Part #: 101370-2202R
R237 R238 = RESISTOR_0: Part #: 100642-4990R
R241-R243 = R: Part #: 100642-4990R
R244-R247 R251 R252 R255-R258 R261 R262 R265 R267 R270 R272 R274 R276-R282 R284 R285 R287 R288 = RESISTOR_0: Part #: R0402-NOPOP
R248 R249 R253 R254 R259 R260 R263 R264 R268 R269 R271 R275 R283 R286 = RESISTOR_0: Part #: 101370-2002R
R250 = RESISTOR_0: Part #: 101370-0001R
R266 = RESISTOR_0: Part #: 100642-3012R
R273 = RESISTOR_0: Part #: 101370-1003R
R333 R389 = R: Part #: 101370-0001R
TP13-TP16 = TEST POINT: Part #: 100115-0001R
U41 = KS8995_multi_0: Part #: 102795-0001R
U42 = OSC_0: Part Number: OSC-66M-01; Part #: 100983-0050R; Part Type: Oscillator
Y3 = CRYSTAL_0: Part # Alt: 101590-0250R; Part #: NO-POP

## Sheet SH23 - AIC PHONE AIC.SchDoc
size 386 x 246 mm
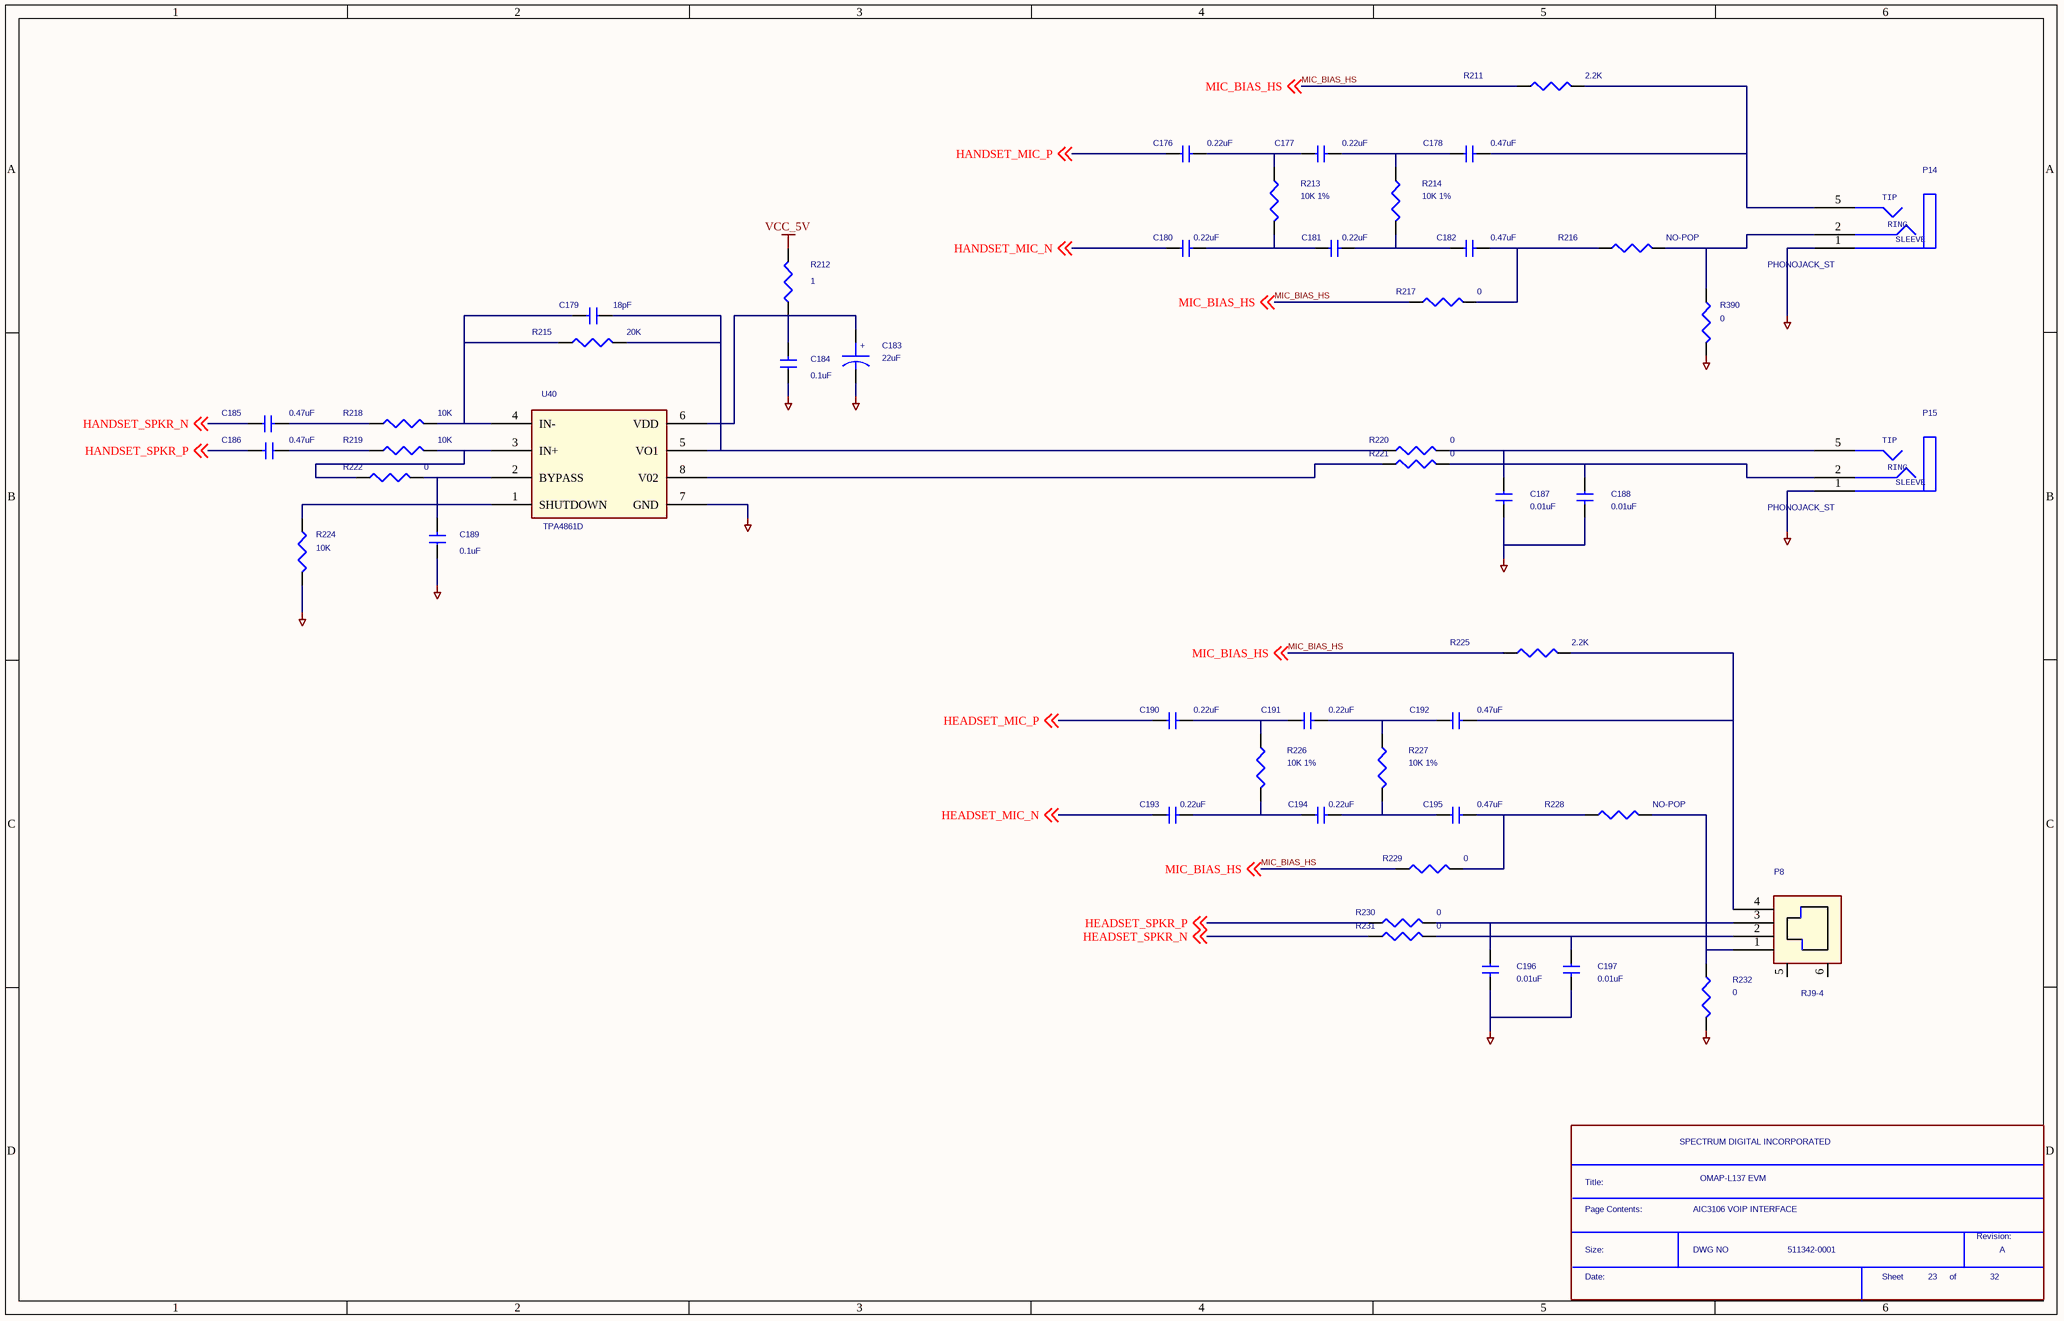
[diagram p9: SH23 - AIC PHONE AIC.SchDoc]

### Parts
(Parts that share a designator on the sheet are numbered #1, #2 ... from top to bottom, then left to right.)
*#10  Page Contents:: AIC3106 VOIP INTERFACE  RevCode: A  Title: OMAP-L137 EVM  OrgName: SPECTRUM DIGITAL INCORPORATED  Doc: 511342-0001  Page Number: 23  Page Count: 32  (hidden comment: SDTitleBlock)  (graphical)
C176  0.22uF  [c603-35x45]
C177  0.22uF  [c603-35x45]
C178  0.47uF  [c603-35x45]
C179  18pF  [c603-35x45]
C180  0.22uF  [c603-35x45]
C181  0.22uF  [c603-35x45]
C182  0.47uF  [c603-35x45]
C183  22uF  [C1206-40X70]
C184  0.1uF  [c402-25]
C185  0.47uF  [c603-35x45]
C186  0.47uF  [c603-35x45]
C187  0.01uF  [c402-25]
C188  0.01uF  [c402-25]
C189  0.1uF  [c402-25]
C190  0.22uF  [c603-35x45]
C191  0.22uF  [c603-35x45]
C192  0.47uF  [c603-35x45]
C193  0.22uF  [c603-35x45]
C194  0.22uF  [c603-35x45]
C195  0.47uF  [c603-35x45]
C196  0.01uF  [c402-25]
C197  0.01uF  [c402-25]
P8  RJ9-4  [molex-52018]
P14  PHONOJACK_ST  [cui3533-10070]
P15  PHONOJACK_ST  [cui3533-10070]
R211  2.2K  [r402-25]
R212  1  [r603-35X45]
R213  10K 1%  [r402-25]
R214  10K 1%  [r402-25]
R215  20K  [r402-25]
R216  NO-POP  [r402-25]
R217  0  [r402-25]
R218  10K  [r402-25]
R219  10K  [r402-25]
R220  0  [r402-25]
R221  0  [r402-25]
R222  0  [r402-25]
R224  10K  [r402-25]
R225  2.2K  [r402-25]
R226  10K 1%  [r402-25]
R227  10K 1%  [r402-25]
R228  NO-POP  [r402-25]
R229  0  [r402-25]
R230  0  [r402-25]
R231  0  [r402-25]
R232  0  [r402-25]
R390  0  [r402-25]
U40  TPA4861D  [so8-25x75]

### Nets
GND_AIC: C183.2 C184.1 C187.2 C188.2 C189.1 C196.2 C197.2 P14.1 P15.1 R224.2 R232.2 R390.2 U40.7(GND)  [project net GND]
VCC_5V: R212.2
HANDSET_MIC_N: C180.1 ; off-sheet HANDSET_MIC_N
HANDSET_MIC_P: C176.1 ; off-sheet HANDSET_MIC_P
HANDSET_SPKR_N: C185.1 ; off-sheet HANDSET_SPKR_N
HANDSET_SPKR_P: C186.2 ; off-sheet HANDSET_SPKR_P
HEADSET_MIC_N: C193.1 ; off-sheet HEADSET_MIC_N
HEADSET_MIC_P: C190.1 ; off-sheet HEADSET_MIC_P
HEADSET_SPKR_N: R231.1 ; off-sheet HEADSET_SPKR_N
HEADSET_SPKR_P: R230.1 ; off-sheet HEADSET_SPKR_P
MIC_BIAS_HS: R211.1 R217.1 R225.1 R229.1 ; off-sheet MIC_BIAS_HS
NetC176_2: C176.2 C177.1 R213.1
NetC177_2: C177.2 C178.1 R214.1
NetC178_2: C178.2 P14.5 R211.2
NetC179_1: C179.1 R215.2 R220.1 U40.5(VO1)
NetC179_2: C179.2 R215.1 R218.2 U40.4(IN-)
NetC180_2: C180.2 C181.1 R213.2
NetC181_2: C181.2 C182.1 R214.2
NetC182_2: C182.2 R216.1 R217.2
NetC183_1: C183.1 C184.2 R212.1 U40.6(VDD)
NetC185_2: C185.2 R218.1
NetC186_1: C186.1 R219.1
NetC187_1: C187.1 P15.5 R220.2
NetC188_1: C188.1 P15.2 R221.2
NetC189_2: C189.2 R222.2 U40.2(BYPASS)
NetC190_2: C190.2 C191.1 R226.1
NetC191_2: C191.2 C192.1 R227.1
NetC192_2: C192.2 P8.4 R225.2
NetC193_2: C193.2 C194.1 R226.2
NetC194_2: C194.2 C195.1 R227.2
NetC195_2: C195.2 R228.1 R229.2
NetC196_1: C196.1 P8.3 R230.2
NetC197_1: C197.1 P8.2 R231.2
NetP8_1: P8.1 R228.2 R232.1
NetP14_2: P14.2 R216.2 R390.1
NetR219_2: R219.2 R222.1 U40.3(IN+)
NetR221_1: R221.1 U40.8(V02)
NetR224_1: R224.1 U40.1(SHUTDOWN)

Not connected (* = marked no-connect by the designer): P8 5 6

### Notes on the sheet
- (in symbol CAPACITOR POL_0) +
- (in symbol PHONOJACK_ST_1) TIP; RING; SLEEVE
- (in symbol SDTitleBlock) Title:; Page Contents:; Revision:; Size:; DWG NO; Date:; Sheet; of

### Library data of the parts
C176 C177 C180 C181 C190 C191 C193 C194 = CAP NP_1: Part #: 101005-1220R
C178 C182 C185 C186 C192 C195 = CAP NP_1: Part #: 101007-1470R
C179 = CAP NP_1: Part #: 101103-1184R
C183 = CAPACITOR POL_0: Part #: 101064-0221R
C184 C189 = CAP NP_1: Part #: 101587-1100R
C187 C188 C196 C197 = CAP NP_1: Part #: 101587-1101R
P8 = RJ11-4_0: Part #: 100057-0001
P14 P15 = PHONOJACK_ST_1
R211 R225 = R_0: Part #: 101370-2202R
R212 = R: Part #: 100687-0100R
R213 R214 R226 R227 = R_0: Part #: 102145-1003R
R215 = R: Part #: 101370-2003R
R216 R228 = R_0: Part #: R0402-NOPOP
R217 R220 R221 R229-R232 = R_0: Part #: 101370-0001R
R218 R219 R224 = R: Part #: 101370-1003R
R222 R390 = R: Part #: 101370-0001R
U40 = TPA4861D: Part #: 100962-0001R

## Sheet SH22 - AIC3106.SchDoc
size 386 x 246 mm
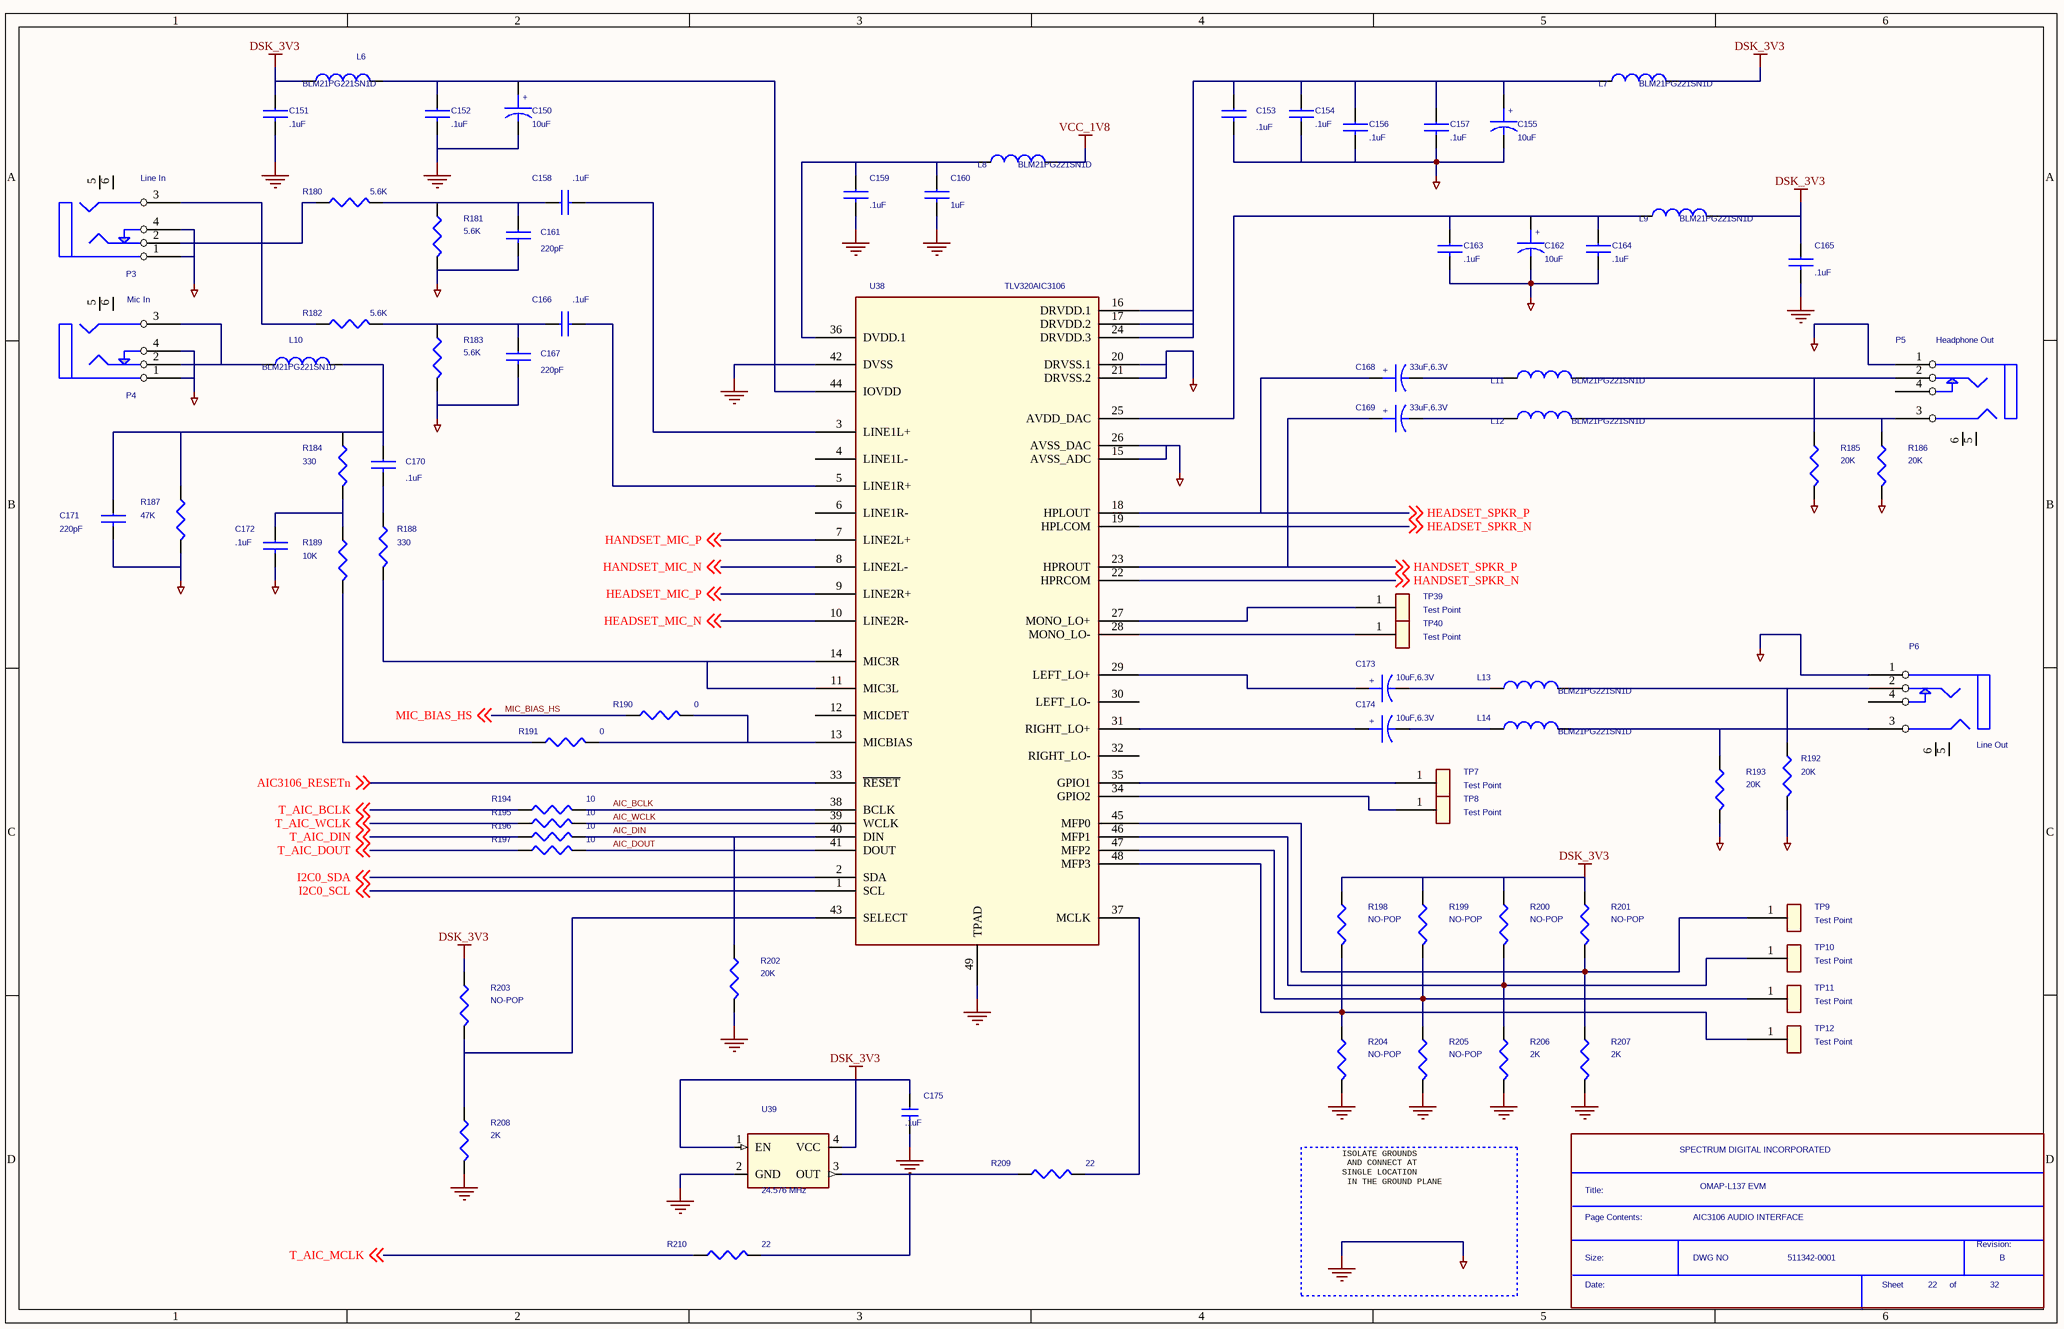
[diagram p10: SH22 - AIC3106.SchDoc]

### Parts
(Parts that share a designator on the sheet are numbered #1, #2 ... from top to bottom, then left to right.)
*#11  Page Contents:: AIC3106 AUDIO INTERFACE  RevCode: B  Title: OMAP-L137 EVM  OrgName: SPECTRUM DIGITAL INCORPORATED  Doc: 511342-0001  Page Number: 22  Page Count: 32  (hidden comment: SDTitleBlock)  (graphical)
C150  10uF  [c1206-40x70-POL]
C151  .1uF  [c402-25]
C152  .1uF  [c402-25]
C153  .1uF  [c402-25]
C154  .1uF  [c402-25]
C155  10uF  [c1206-40x70-POL]
C156  .1uF  [c402-25]
C157  .1uF  [c402-25]
C158  .1uF  [c402-25]
C159  .1uF  [c402-25]
C160  1uF  [c603-35x45]
C161  220pF  [c603-35x45]
C162  10uF  [c1206-40x70-POL]
C163  .1uF  [c402-25]
C164  .1uF  [c402-25]
C165  .1uF  [c402-25]
C166  .1uF  [c402-25]
C167  220pF  [c603-35x45]
C168  33uF,6.3V  [c1206-40x70p]
C169  33uF,6.3V  [c1206-40x70p]
C170  .1uF  [c402-25]
C171  220pF  [c603-35x45]
C172  .1uF  [c402-25]
C173  10uF,6.3V  [c1206-40x70-POL]
C174  10uF,6.3V  [c1206-40x70-POL]
C175  .1uF  [c402-25]
L6  BLM21PG221SN1D  [l805-35x60]
L7  BLM21PG221SN1D  [l805-35x60]
L8  BLM21PG221SN1D  [l805-35x60]
L9  BLM21PG221SN1D  [l805-35x60]
L10  BLM21PG221SN1D  [l805-35x60]
L11  BLM21PG221SN1D  [l805-35x60]
L12  BLM21PG221SN1D  [l805-35x60]
L13  BLM21PG221SN1D  [l805-35x60]
L14  BLM21PG221SN1D  [l805-35x60]
P3  Line In  [st_3500]
P4  Mic In  [st_3500]
P5  Headphone Out  [st_3500]
P6  Line Out  [st_3500]
R180  5.6K  [r603-35x45]
R181  5.6K  [r603-35x45]
R182  5.6K  [r603-35x45]
R183  5.6K  [r603-35x45]
R184  330  [r402-25]
R185  20K  [r402-25]
R186  20K  [r402-25]
R187  47K  [r402-25]
R188  330  [r402-25]
R189  10K  [r402-25]
R190  0  [r402-25]
R191  0  [r402-25]
R192  20K  [r402-25]
R193  20K  [r402-25]
R194  10  [r402-25]
R195  10  [r402-25]
R196  10  [r402-25]
R197  10  [r402-25]
R198  NO-POP  [r402-25]
R199  NO-POP  [r402-25]
R200  NO-POP  [r402-25]
R201  NO-POP  [r402-25]
R202  20K  [r402-25]
R203  NO-POP  [r402-25]
R204  NO-POP  [r402-25]
R205  NO-POP  [r402-25]
R206  2K  [r402-25]
R207  2K  [r402-25]
R208  2K  [r402-25]
R209  22  [r402-25]
R210  22  [r402-25]
TP7  Test Point  [tp1-6040]
TP8  Test Point  [tp1-6040]
TP9  Test Point  [tp1-6040]
TP10  Test Point  [tp1-6040]
TP11  Test Point  [tp1-6040]
TP12  Test Point  [tp1-6040]
TP39  Test Point  [tp1-6040]
TP40  Test Point  [tp1-6040]
U38  TLV320AIC3106  [rgz48-11x34]
U39  24.576 MHz  [xtal4-70x78-ctx]

### Nets
DSK_3V3: C151.1 C165.1 C175.1 L6.1 L7.2 L9.2 R198.1 R199.1 R200.1 R201.1 R203.1 U39.1(EN) U39.4(VCC)
GND: C150.2 C151.2 C152.2 C153.2 C154.2 C155.2 C156.2 C157.2 C159.2 C160.2 C161.2 C162.2 C163.2 C164.2 C165.2 C167.2 C171.2 C172.2 C175.2 P3.1(SHIELD) P3.4(TIPB) P4.1(SHIELD) P4.4(TIPB) P5.1(SHIELD) P6.1(SHIELD) R181.2 R183.2 R185.2 R186.2 R187.2 R192.2 R193.2 R202.2 R204.2 R205.2 R206.2 R207.2 R208.2 U38.15(AVSS_ADC) U38.20(DRVSS.1) U38.21(DRVSS.2) U38.26(AVSS_DAC) U38.42(DVSS) U38.49(TPAD) U39.2(GND)  [also labelled GND_AIC]
VCC_1V8: L8.2
AIC3106_RESETn: U38.33(~{RESET}) ; off-sheet AIC3106_RESETn
AIC_BCLK: R194.2 U38.38(BCLK)
AIC_DIN: R196.2 R202.1 U38.40(DIN)
AIC_DOUT: R197.2 U38.41(DOUT)
AIC_WCLK: R195.2 U38.39(WCLK)
HANDSET_MIC_N: U38.8(LINE2L-) ; off-sheet HANDSET_MIC_N
HANDSET_MIC_P: U38.7(LINE2L+) ; off-sheet HANDSET_MIC_P
HANDSET_SPKR_N: U38.22(HPRCOM) ; off-sheet HANDSET_SPKR_N
HANDSET_SPKR_P: C169.1 U38.23(HPROUT) ; off-sheet HANDSET_SPKR_P
HEADSET_MIC_N: U38.10(LINE2R-) ; off-sheet HEADSET_MIC_N
HEADSET_MIC_P: U38.9(LINE2R+) ; off-sheet HEADSET_MIC_P
HEADSET_SPKR_N: U38.19(HPLCOM) ; off-sheet HEADSET_SPKR_N
HEADSET_SPKR_P: C168.1 U38.18(HPLOUT) ; off-sheet HEADSET_SPKR_P
I2C0_SCL: U38.1(SCL) ; off-sheet I2C0_SCL
I2C0_SDA: U38.2(SDA) ; off-sheet I2C0_SDA
MIC_BIAS_HS: R190.1 ; off-sheet MIC_BIAS_HS
T_AIC_BCLK: R194.1 ; off-sheet T_AIC_BCLK
T_AIC_DIN: R196.1 ; off-sheet T_AIC_DIN
T_AIC_DOUT: R197.1 ; off-sheet T_AIC_DOUT
T_AIC_MCLK: R210.1 ; off-sheet T_AIC_MCLK
T_AIC_WCLK: R195.1 ; off-sheet T_AIC_WCLK
NetC150_1: C150.1 C152.1 L6.2 U38.44(IOVDD)
NetC153_1: C153.1 C154.1 C155.1 C156.1 C157.1 L7.1 U38.16(DRVDD.1) U38.17(DRVDD.2) U38.24(DRVDD.3)
NetC158_1: C158.1 C161.1 R180.2 R181.1
NetC158_2: C158.2 U38.3(LINE1L+)
NetC159_1: C159.1 C160.1 L8.1 U38.36(DVDD.1)
NetC162_1: C162.1 C163.1 C164.1 L9.1 U38.25(AVDD_DAC)
NetC166_1: C166.1 C167.1 R182.2 R183.1
NetC166_2: C166.2 U38.5(LINE1R+)
NetC168_2: C168.2 L11.1
NetC169_2: C169.2 L12.1
NetC170_1: C170.1 C171.1 L10.2 R184.1 R187.1
NetC170_2: C170.2 R188.1
NetC172_1: C172.1 R184.2 R189.1
NetC173_1: C173.1 U38.29(LEFT_LO+)
NetC173_2: C173.2 L13.1
NetC174_1: C174.1 U38.31(RIGHT_LO+)
NetC174_2: C174.2 L14.1
NetL10_1: L10.1 P4.2(TIP) P4.3(RING)
NetL11_2: L11.2 P5.2(TIP) R185.1
NetL12_2: L12.2 P5.3(RING) R186.1
NetL13_2: L13.2 P6.2(TIP) R192.1
NetL14_2: L14.2 P6.3(RING) R193.1
NetP3_2: P3.2(TIP) R180.1
NetP3_3: P3.3(RING) R182.1
NetR188_2: R188.2 U38.11(MIC3L) U38.14(MIC3R)
NetR189_2: R189.2 R191.1
NetR190_2: R190.2 R191.2 U38.13(MICBIAS)
NetR198_2: R198.2 R204.1 TP12.1 U38.48(MFP3)
NetR199_2: R199.2 R205.1 TP11.1 U38.47(MFP2)
NetR200_2: R200.2 R206.1 TP10.1 U38.46(MFP1)
NetR201_2: R201.2 R207.1 TP9.1 U38.45(MFP0)
NetR203_2: R203.2 R208.1 U38.43(SELECT)
NetR209_1: R209.1 R210.2 U39.3(OUT)
NetR209_2: R209.2 U38.37(MCLK)
NetTP7_1: TP7.1 U38.35(GPIO1)
NetTP8_1: TP8.1 U38.34(GPIO2)
NetTP39_1: TP39.1 U38.27(MONO_LO+)
NetTP40_1: TP40.1 U38.28(MONO_LO-)

Not connected (* = marked no-connect by the designer): P3 5(MH1) 6(MH2); P4 5(MH1) 6(MH2); P5 4(TIPB) 5(MH1) 6(MH2); P6 4(TIPB) 5(MH1) 6(MH2); U38 4(LINE1L-) 6(LINE1R-) 12(MICDET) 30(LEFT_LO-) 32(RIGHT_LO-)

### Notes on the sheet
- ISOLATE GROUNDS
  AND CONNECT AT
  SINGLE LOCATION
  IN THE GROUND PLANE
- (in symbol CAPACITOR POL_0) +
- (in symbol SDTitleBlock) Title:; Page Contents:; Revision:; Size:; DWG NO; Date:; Sheet; of

### Library data of the parts
C150 C155 C162 C173 C174 = CAPACITOR POL_0: Part #: 101003-0101R; Buy: D/K P#335 P2032-ND
C151-C154 C156-C159 C163-C166 C170 C172 = CAP NP: Part #: 101587-1100R
C160 = CAP NP: Part #: 101007-0100R
C161 C167 C171 = CAP NP: Part #: 100993-1223R
C168 C169 = CAPACITOR POL_0: Part #: 101953-0331R; Buy: D/K P#335 P2032-ND
C175 = CAP NP_1: Part #: 101587-1100R
L6-L14 = INDUCTOR: Part #: 101228-2201R
P3-P6 = Kycon ST-3500_0: Part #: 101012-0001R
R180-R183 = R_0: Part #: 100687-5602R
R184 R188 = R_0: Part #: 101370-3301R
R185 R186 R192 R193 R202 = R_0: Part #: 101370-2003R
R187 = R_0: Part #: 101370-4703R
R189 = R_0: Part #: 101370-1003R
R190 R191 = R_0: Part #: 101370-0001R
R194-R197 = R_0: Part #: 101370-1000R
R198-R201 R203-R205 = R_0: Part #: R0402-NOPOP
R206-R208 = R_0: Part #: 101370-2002R
R209 R210 = RESISTOR: Part #: 101370-2200R
TP7-TP12 TP39 TP40 = TEST POINT: Part #: 100115-0001R
U38 = TLV320AIC3106_0: Part #: 102800-0001R
U39 = OSC4/SM_0: Part #: 102201-2457R; SD PCB Footprint: CB3LV